# EAGLE design circuit (EAGLE 6.5.0)
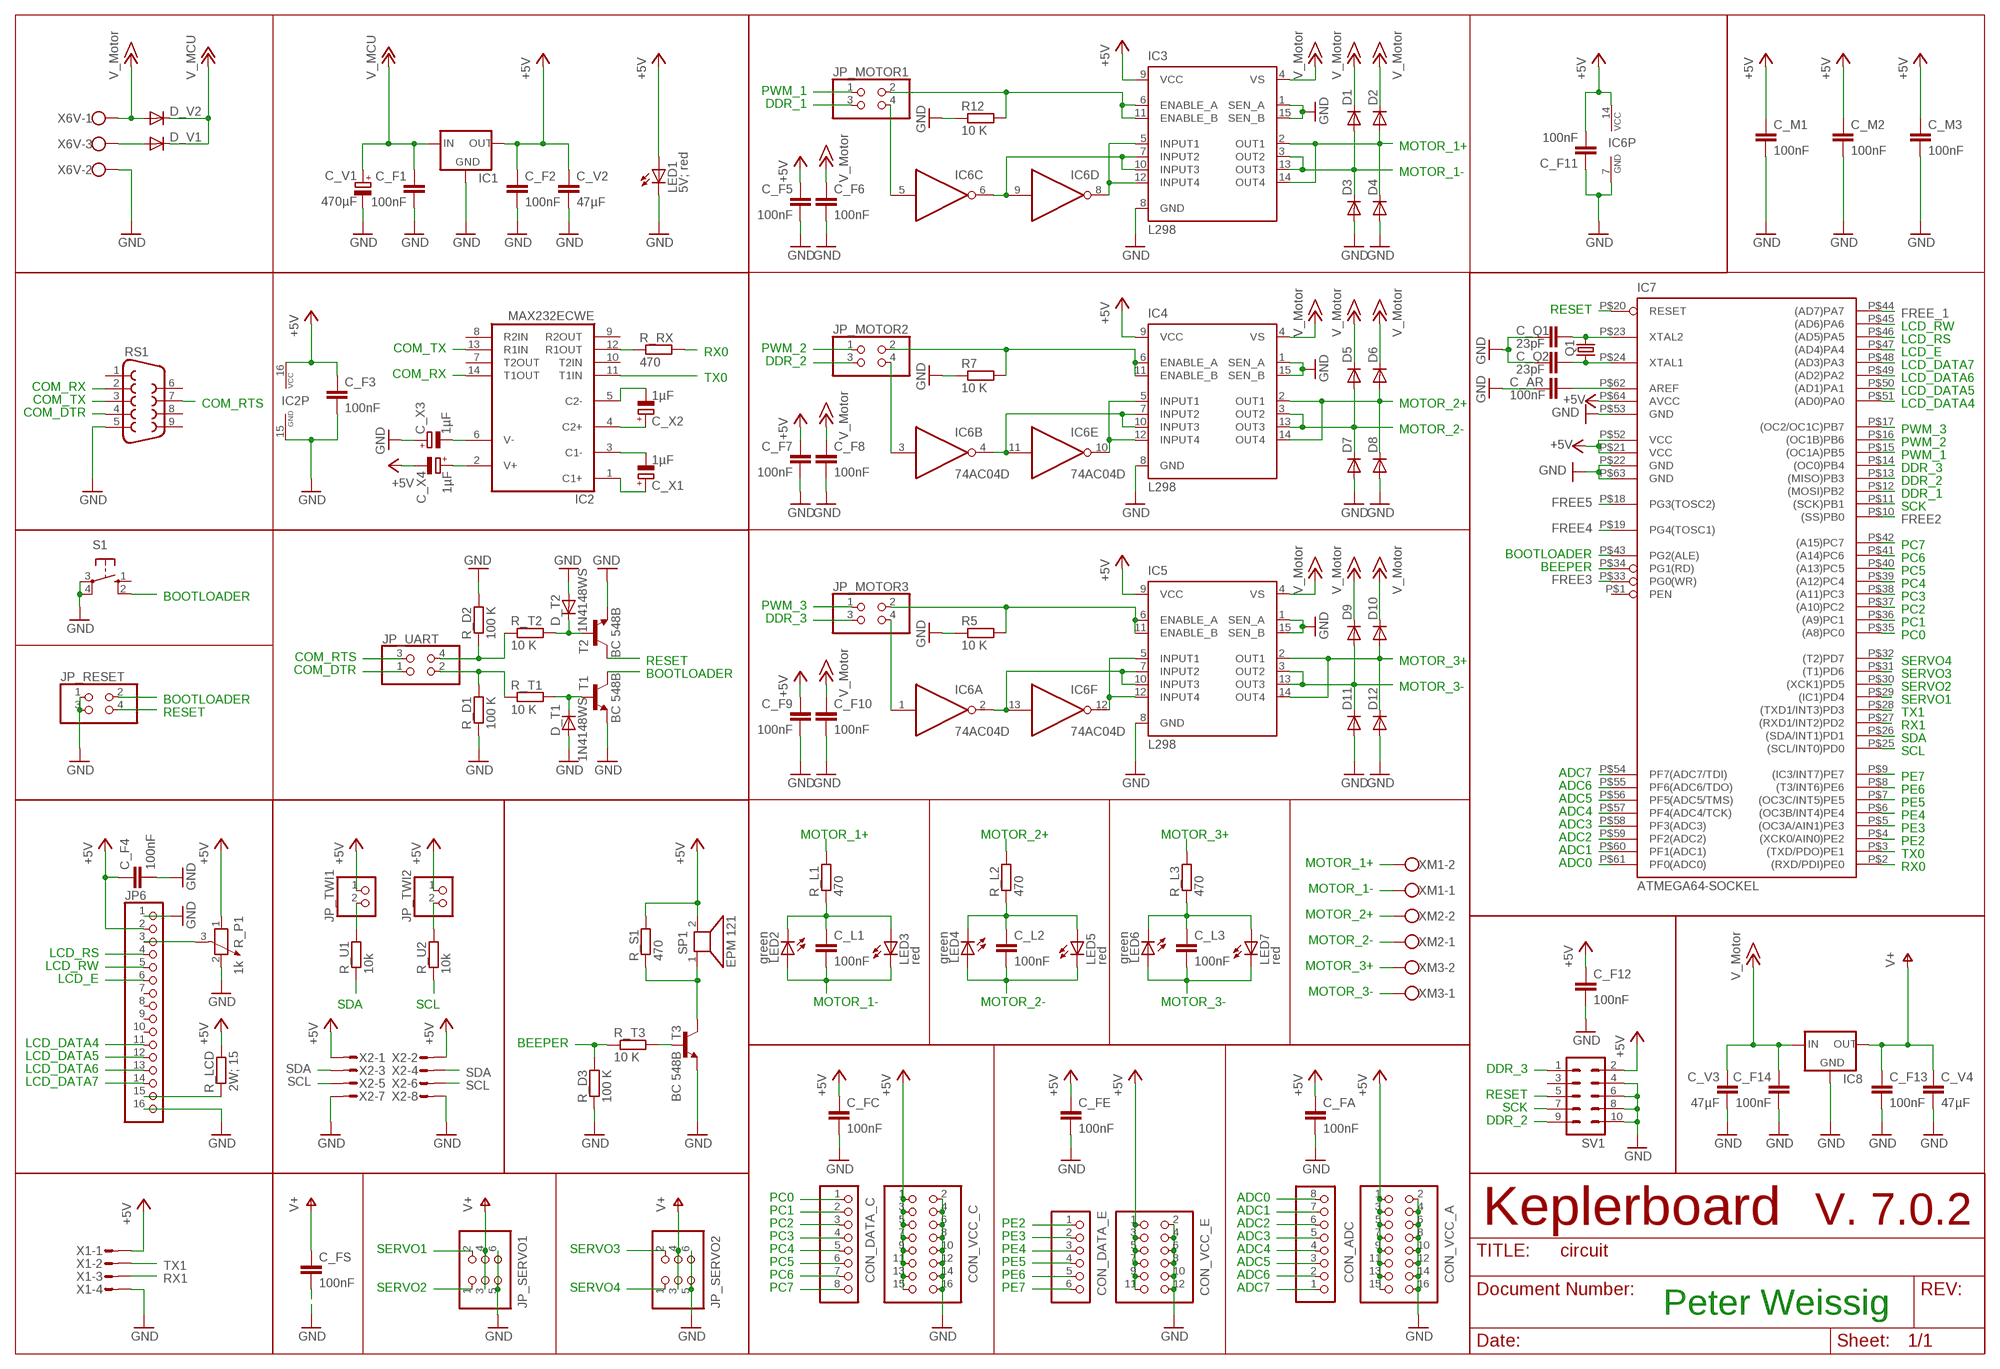
[diagram p0: schematic, sheet 1]

## Parts
C_AR  100nF  C-EU025-025X050  [C025-025X050]
C_F1  100nF  C-EUC1206K  [C1206K]
C_F2  100nF  C-EUC1206K  [C1206K]
C_F3  100nF  C-EUC1206K  [C1206K]
C_F4  100nF  C-EU025-025X050  [C025-025X050]
C_F5  100nF  C-EUC1206K  [C1206K]
C_F6  100nF  C-EUC1206K  [C1206K]
C_F7  100nF  C-EUC1206K  [C1206K]
C_F8  100nF  C-EUC1206K  [C1206K]
C_F9  100nF  C-EUC1206K  [C1206K]
C_F10  100nF  C-EUC1206K  [C1206K]
C_F11  100nF  C-EUC1206K  [C1206K]
C_F12  100nF  C-EUC1206K  [C1206K]
C_F13  100nF  C-EUC1206K  [C1206K]
C_F14  100nF  C-EUC1206K  [C1206K]
C_FA  100nF  C-EU025-025X050  [C025-025X050]
C_FC  100nF  C-EU025-025X050  [C025-025X050]
C_FE  100nF  C-EU025-025X050  [C025-025X050]
C_FS  100nF  C-EUC1206K  [C1206K]
C_L1  100nF  C-EUC1206K  [C1206K]
C_L2  100nF  C-EUC1206K  [C1206K]
C_L3  100nF  C-EUC1206K  [C1206K]
C_M1  100nF  C-EU025-025X050  [C025-025X050]
C_M2  100nF  C-EU025-025X050  [C025-025X050]
C_M3  100nF  C-EU025-025X050  [C025-025X050]
C_Q1  23pF  C-EUC3216  [C3216]
C_Q2  23pF  C-EUC3216  [C3216]
C_V1  470µF  CPOL-EUE5-10.5  [E5-10,5]
C_V2  47µF  C-EUC1210K  [C1210K]
C_V3  47µF  C-EUC1210K  [C1210K]
C_V4  47µF  C-EUC1210K  [C1210K]
C_X1  1µF  CPOL-EUA/3216-18W  [A/3216-18W]
C_X2  1µF  CPOL-EUA/3216-18W  [A/3216-18W]
C_X3  1µF  CPOL-EUA/3216-18W  [A/3216-18W]
C_X4  1µF  CPOL-EUA/3216-18W  [A/3216-18W]
CON_ADC  PINHD-1X8  [1X08]
CON_DATA_C  PINHD-1X8  [1X08]
CON_DATA_E  PINHD-1X6  [1X06]
CON_VCC_A  PINHD-2X8  [2X08]
CON_VCC_C  PINHD-2X8  [2X08]
CON_VCC_E  PINHD-2X6  [2X06]
D1  DIODE-SMC  [SMC]
D2  DIODE-SMC  [SMC]
D3  DIODE-SMC  [SMC]
D4  DIODE-SMC  [SMC]
D5  DIODE-SMC  [SMC]
D6  DIODE-SMC  [SMC]
D7  DIODE-SMC  [SMC]
D8  DIODE-SMC  [SMC]
D9  DIODE-SMC  [SMC]
D10  DIODE-SMC  [SMC]
D11  DIODE-SMC  [SMC]
D12  DIODE-SMC  [SMC]
D_T1  1N4148WS  DIODE-SOD323-W  [SOD323-W]
D_T2  1N4148WS  DIODE-SOD323-W  [SOD323-W]
D_V1  DIODE-SMC  [SMC]
D_V2  DIODE-SMC  [SMC]
IC1  78XXS  [78XXS]
IC2  MAX232ECWE  [SO16L]
IC3  L298  [MULTIWATT-15]
IC4  L298  [MULTIWATT-15]
IC5  L298  [MULTIWATT-15]
IC6  74AC04D  [SO14]
IC7  ATMEGA64-SOCKEL  [SOCKEL_TQFP64]
IC8  78XXS  [78XXS]
JP6  PINHD-1X16  [1X16]
JP_MOTOR1  PINHD-2X2  [2X02]
JP_MOTOR2  PINHD-2X2  [2X02]
JP_MOTOR3  PINHD-2X2  [2X02]
JP_RESET  PINHD-2X2  [2X02]
JP_SERVO1  PINHD-2X3  [2X03]
JP_SERVO2  PINHD-2X3  [2X03]
JP_TWI1  PINHD-1X2  [1X02]
JP_TWI2  PINHD-1X2  [1X02]
JP_UART  PINHD-2X2  [2X02]
LED1  5V; red  LED3MM  [LED3MM]
LED2  green  LEDCHIPLED_1206  [CHIPLED_1206]
LED3  red  LEDCHIPLED_1206  [CHIPLED_1206]
LED4  green  LEDCHIPLED_1206  [CHIPLED_1206]
LED5  red  LEDCHIPLED_1206  [CHIPLED_1206]
LED6  green  LEDCHIPLED_1206  [CHIPLED_1206]
LED7  red  LEDCHIPLED_1206  [CHIPLED_1206]
Q1  CRYSTALHC49UP  [HC49UP]
R5  10 K  R-EU_R1206  [R1206]
R7  10 K  R-EU_R1206  [R1206]
R12  10 K  R-EU_R1206  [R1206]
R_D1  100 K  R-EU_R1206  [R1206]
R_D2  100 K  R-EU_R1206  [R1206]
R_D3  100 K  R-EU_R1206  [R1206]
R_L1  470  R-EU_R1206  [R1206]
R_L2  470  R-EU_R1206  [R1206]
R_L3  470  R-EU_R1206  [R1206]
R_LCD  2W; 15  R-EU_0414/15  [0414/15]
R_P1  1k  POTENTIOMETER_PT-10  [PT-10]
R_RX  470  R-EU_R1206  [R1206]
R_S1  470  R-EU_R1206  [R1206]
R_T1  10 K  R-EU_R1206  [R1206]
R_T2  10 K  R-EU_R1206  [R1206]
R_T3  10 K  R-EU_R1206  [R1206]
R_U1  10k  R-EU_R1206  [R1206]
R_U2  10k  R-EU_R1206  [R1206]
RS1  F09H  [F09H]
S1  TASTER  [TASTER_SMD]
SP1  EPM 121  AL60P  [AL60P]
SV1  ML10  [ML10]
T1  BC 548B  2N3565  [TO92]
T2  BC 548B  2N3565  [TO92]
T3  BC 548B  2N3565  [TO92]
X1  MICROMATCH-4  [MICROMATCH-4]
X2  MICROMATCH-8  [MICROMATCH-8]
X6V  W237-103  [W237-103]
XM1  W237-102  [W237-102]
XM2  W237-102  [W237-102]
XM3  W237-102  [W237-102]

## Nets
+5V: C_F2.1 C_F3.1 C_F4.1 C_F5.1 C_F7.1 C_F9.1 C_F11.2 C_F12.1 C_FA.1 C_FC.1 C_FE.1 C_M1.1 C_M2.1 C_M3.1 C_V2.1 C_X4.- CON_VCC_A.1 CON_VCC_A.3 CON_VCC_A.5 CON_VCC_A.7 CON_VCC_A.9 CON_VCC_A.11 CON_VCC_A.13 CON_VCC_A.15 CON_VCC_C.1 CON_VCC_C.3 CON_VCC_C.5 CON_VCC_C.7 CON_VCC_C.9 CON_VCC_C.11 CON_VCC_C.13 CON_VCC_C.15 CON_VCC_E.1 CON_VCC_E.3 CON_VCC_E.5 CON_VCC_E.7 CON_VCC_E.9 CON_VCC_E.11 IC1.OUT IC2.16(VCC) IC3.9(VCC) IC4.9(VCC) IC5.9(VCC) IC6.14(P:VCC) IC7.P$21(VCC) IC7.P$52(VCC) IC7.P$64(AVCC) JP6.2 JP_TWI1.1 JP_TWI2.1 LED1.A R_LCD.1 R_P1.1 R_S1.2 SP1.2 SV1.2 X1.1 X2.1 X2.2
+12V: C_F1.1 C_V1.+ D_V1.C D_V2.C IC1.IN ; supply symbol labelled V_MCU
+15V: C_F6.1 C_F8.1 C_F10.1 C_F14.1 C_V3.1 D1.C D2.C D5.C D6.C D9.C D10.C D_V2.A IC3.4(VS) IC4.4(VS) IC5.4(VS) IC8.IN X6V.1 ; supply symbol labelled V_Motor
ADC0: CON_ADC.8 IC7.P$61(PF0(ADC0))
ADC1: CON_ADC.7 IC7.P$60(PF1(ADC1))
ADC2: CON_ADC.6 IC7.P$59(PF2(ADC2))
ADC3: CON_ADC.5 IC7.P$58(PF3(ADC3))
ADC4: CON_ADC.4 IC7.P$57(PF4(ADC4/TCK))
ADC5: CON_ADC.3 IC7.P$56(PF5(ADC5/TMS))
ADC6: CON_ADC.2 IC7.P$55(PF6(ADC6/TDO))
ADC7: CON_ADC.1 IC7.P$54(PF7(ADC7/TDI))
BEEPER: IC7.P$34(PG1(RD)) R_D3.2 R_T3.1
BOOTLOADER: IC7.P$43(PG2(ALE)) JP_RESET.2 S1.2(S1) T1.1(C)
COM_DTR: JP_UART.1 RS1.4
COM_RTS: JP_UART.3 RS1.7
COM_RX: IC2.14(T1OUT) RS1.2
COM_TX: IC2.13(R1IN) RS1.3
DDR_1: IC7.P$12((MOSI)PB2) JP_MOTOR1.3
DDR_2: IC7.P$13((MISO)PB3) JP_MOTOR2.3 SV1.9
DDR_3: IC7.P$14((OC0)PB4) JP_MOTOR3.3 SV1.1
FREE2: IC7.P$10((SS)PB0)
FREE3: IC7.P$33(PG0(WR))
FREE4: IC7.P$19(PG4(TOSC1))
FREE5: IC7.P$18(PG3(TOSC2))
FREE_1: IC7.P$44((AD7)PA7)
GND: C_AR.1 C_F1.2 C_F2.2 C_F3.2 C_F4.2 C_F5.2 C_F6.2 C_F7.2 C_F8.2 C_F9.2 C_F10.2 C_F11.1 C_F12.2 C_F13.2 C_F14.2 C_FA.2 C_FC.2 C_FE.2 C_FS.2 C_M1.2 C_M2.2 C_M3.2 C_Q1.1 C_Q2.1 C_V1.- C_V2.2 C_V3.2 C_V4.2 C_X3.+ CON_VCC_A.2 CON_VCC_A.4 CON_VCC_A.6 CON_VCC_A.8 CON_VCC_A.10 CON_VCC_A.12 CON_VCC_A.14 CON_VCC_A.16 CON_VCC_C.2 CON_VCC_C.4 CON_VCC_C.6 CON_VCC_C.8 CON_VCC_C.10 CON_VCC_C.12 CON_VCC_C.14 CON_VCC_C.16 CON_VCC_E.2 CON_VCC_E.4 CON_VCC_E.6 CON_VCC_E.8 CON_VCC_E.10 CON_VCC_E.12 D3.A D4.A D7.A D8.A D11.A D12.A D_T1.A D_T2.A IC1.GND IC2.15(GND) IC3.1(SEN_A) IC3.8(GND) IC3.15(SEN_B) IC4.1(SEN_A) IC4.8(GND) IC4.15(SEN_B) IC5.1(SEN_A) IC5.8(GND) IC5.15(SEN_B) IC6.7(P:GND) IC7.P$22(GND) IC7.P$53(GND) IC7.P$63(GND) IC8.GND JP6.1 JP6.16 JP_RESET.1 JP_RESET.3 JP_SERVO1.5 JP_SERVO1.6 JP_SERVO2.5 JP_SERVO2.6 LED1.K(C) R5.1 R7.1 R12.1 R_D1.1 R_D2.2 R_D3.1 R_P1.2 RS1.5 S1.3(P) S1.4(P1) SV1.4 SV1.6 SV1.8 SV1.10 T1.3(E) T2.3(E) T3.3(E) X1.4 X2.7 X2.8 X6V.2
LCD_DATA4: IC7.P$51((AD0)PA0) JP6.11
LCD_DATA5: IC7.P$50((AD1)PA1) JP6.12
LCD_DATA6: IC7.P$49((AD2)PA2) JP6.13
LCD_DATA7: IC7.P$48((AD3)PA3) JP6.14
LCD_E: IC7.P$47((AD4)PA4) JP6.6
LCD_RS: IC7.P$46((AD5)PA5) JP6.4
LCD_RW: IC7.P$45((AD6)PA6) JP6.5
MOTOR_1+: D2.A D4.C IC3.2(OUT1) IC3.14(OUT4) R_L1.2 XM1.2
MOTOR_1-: C_L1.2 D1.A D3.C IC3.3(OUT2) IC3.13(OUT3) LED2.A LED3.C XM1.1
MOTOR_2+: D6.A D8.C IC4.2(OUT1) IC4.14(OUT4) R_L2.2 XM2.2
MOTOR_2-: C_L2.2 D5.A D7.C IC4.3(OUT2) IC4.13(OUT3) LED4.A LED5.C XM2.1
MOTOR_3+: D10.A D12.C IC5.2(OUT1) IC5.14(OUT4) R_L3.2 XM3.2
MOTOR_3-: C_L3.2 D9.A D11.C IC5.3(OUT2) IC5.13(OUT3) LED6.A LED7.C XM3.1
N$2: IC6.3(B:I) JP_MOTOR2.4
N$3: IC4.7(INPUT2) IC4.10(INPUT3) IC6.4(B:O) IC6.11(E:I)
N$4: JP_TWI1.2 R_U1.2
N$5: R_S1.1 SP1.1 T3.1(C)
N$6: R_T3.2 T3.2(B)
N$16: JP6.3 R_P1.3
N$17: C_AR.2 IC7.P$62(AREF)
N$18: IC4.6(ENABLE_A) IC4.11(ENABLE_B) JP_MOTOR2.2 R7.2
N$19: JP_TWI2.2 R_U2.2
N$20: D_V1.A X6V.3
N$21: IC4.5(INPUT1) IC4.12(INPUT4) IC6.10(E:O)
N$37: C_Q1.2 IC7.P$23(XTAL2) Q1.2
N$38: C_L1.1 LED2.C LED3.A R_L1.1
N$40: C_Q2.2 IC7.P$24(XTAL1) Q1.1
N$78: IC5.5(INPUT1) IC5.12(INPUT4) IC6.12(F:O)
N$82: IC6.5(C:I) JP_MOTOR1.4
N$83: IC3.5(INPUT1) IC3.12(INPUT4) IC6.8(D:O)
N$84: IC3.7(INPUT2) IC3.10(INPUT3) IC6.6(C:O) IC6.9(D:I)
N$90: IC6.1(A:I) JP_MOTOR3.4
N$92: JP6.15 R_LCD.2
N$95: D_T2.C R_T2.2 T2.2(B)
N$99: IC5.7(INPUT2) IC5.10(INPUT3) IC6.2(A:O) IC6.13(F:I)
N$101: C_L3.1 LED6.C LED7.A R_L3.1
N$106: C_L2.1 LED4.C LED5.A R_L2.1
N$122: D_T1.C R_T1.2 T1.2(B)
N$123: C_X4.+ IC2.2(V+)
N$124: C_X3.- IC2.6(V-)
N$125: C_X2.+ IC2.4(C2+)
N$126: C_X1.+ IC2.1(C1+)
N$127: C_X1.- IC2.3(C1-)
N$128: C_X2.- IC2.5(C2-)
N$129: JP_UART.2 R_D1.2 R_T1.1
N$130: JP_UART.4 R_D2.1 R_T2.1
N$134: IC2.12(R1OUT) R_RX.1
PC0: CON_DATA_C.1 IC7.P$35((A8)PC0)
PC1: CON_DATA_C.2 IC7.P$36((A9)PC1)
PC2: CON_DATA_C.3 IC7.P$37((A10)PC2)
PC3: CON_DATA_C.4 IC7.P$38((A11)PC3)
PC4: CON_DATA_C.5 IC7.P$39((A12)PC4)
PC5: CON_DATA_C.6 IC7.P$40((A13)PC5)
PC6: CON_DATA_C.7 IC7.P$41((A14)PC6)
PC7: CON_DATA_C.8 IC7.P$42((A15)PC7)
PE2: CON_DATA_E.1 IC7.P$4((XCK0/AIN0)PE2)
PE3: CON_DATA_E.2 IC7.P$5((OC3A/AIN1)PE3)
PE4: CON_DATA_E.3 IC7.P$6((OC3B/INT4)PE4)
PE5: CON_DATA_E.4 IC7.P$7((OC3C/INT5)PE5)
PE6: CON_DATA_E.5 IC7.P$8((T3/INT6)PE6)
PE7: CON_DATA_E.6 IC7.P$9((IC3/INT7)PE7)
PWM_1: IC7.P$15((OC1A)PB5) JP_MOTOR1.1
PWM_2: IC7.P$16((OC1B)PB6) JP_MOTOR2.1
PWM_3: IC7.P$17((OC2/OC1C)PB7) JP_MOTOR3.1
PWMM1: IC3.6(ENABLE_A) IC3.11(ENABLE_B) JP_MOTOR1.2 R12.2
PWMM3: IC5.6(ENABLE_A) IC5.11(ENABLE_B) JP_MOTOR3.2 R5.2
RESET: IC7.P$20(RESET) JP_RESET.4 SV1.5 T2.1(C)
RX0: IC7.P$2((RXD/PDI)PE0) R_RX.2
RX1: IC7.P$27((RXD1/INT2)PD2) X1.3
SCK: IC7.P$11((SCK)PB1) SV1.7
SCL: IC7.P$25((SCL/INT0)PD0) R_U2.1 X2.5 X2.6
SDA: IC7.P$26((SDA/INT1)PD1) R_U1.1 X2.3 X2.4
SERVO1: IC7.P$29((IC1)PD4) JP_SERVO1.2
SERVO2: IC7.P$30((XCK1)PD5) JP_SERVO1.1
SERVO3: IC7.P$31((T1)PD6) JP_SERVO2.2
SERVO4: IC7.P$32((T2)PD7) JP_SERVO2.1
TX0: IC2.11(T1IN) IC7.P$3((TXD/PDO)PE1)
TX1: IC7.P$28((TXD1/INT3)PD3) X1.2
V+: C_F13.1 C_FS.1 C_V4.1 IC8.OUT JP_SERVO1.3 JP_SERVO1.4 JP_SERVO2.3 JP_SERVO2.4
Unconnected: IC2.7(T2OUT) IC2.8(R2IN) IC2.9(R2OUT) IC2.10(T2IN) IC7.P$1(PEN) JP6.7 JP6.8 JP6.9 JP6.10 RS1.1 RS1.6 RS1.8 RS1.9 S1.1(S) SV1.3

## Notes on the sheet
- Keplerboard | V. 7.0.2
- Peter Weissig

## Library data of the parts
C_AR C_F1-C_F14 C_FA C_FC C_FE C_FS C_L1-C_L3 C_M1-C_M3 C_Q1 C_Q2 C_V2-C_V4 = rcl:C-EU: CAPACITOR, European symbol
C_V1 C_X1-C_X4 = rcl:CPOL-EU: POLARIZED CAPACITOR, European symbol
CON_ADC CON_DATA_C = pinhead:PINHD-1X8: PIN HEADER
CON_DATA_E = pinhead:PINHD-1X6: PIN HEADER
CON_VCC_A CON_VCC_C = pinhead:PINHD-2X8: PIN HEADER
CON_VCC_E = pinhead:PINHD-2X6: PIN HEADER
D1-D12 D_T1 D_T2 D_V1 D_V2 = diode:DIODE-: DIODE
IC1 IC8 = v-reg:78XXS: VOLTAGE REGULATOR
IC2 = maxim:MAX232ECWE: RS232 TRANSEIVER
IC3-IC5 = st-microelectronics:L298: DUAL FULL-BRIDGE DRIVER; MPN: L298N; OC_FARNELL: 1589425; OC_NEWARK: 32M1527
IC6 = 74xx-eu:74*04: Hex INVERTER
IC7 = robo_ag:ATMEGA64: MICROCONTROLLER 64 Kbytes FLASH 4 Kbytes SRAM 2 Kbytes EEPROM DUAL USART 8-channel 10 bit ADC Source: avr.lbr
JP6 = pinhead:PINHD-1X16: PIN HEADER
JP_MOTOR1-JP_MOTOR3 JP_RESET JP_UART = pinhead:PINHD-2X2: PIN HEADER
JP_SERVO1 JP_SERVO2 = pinhead:PINHD-2X3: PIN HEADER
JP_TWI1 JP_TWI2 = pinhead:PINHD-1X2: PIN HEADER
LED1-LED7 = led:LED: LED OSRAM: - CHIPLED LG R971, LG N971, LY N971, LG Q971, LY Q971, LO R971, LY R971 LH N974, LH R974 LS Q976, LO Q976, LY Q976 LO Q996 - Hyper CHIPLED LW Q18S LB Q993, LB Q99A, LB R99A - SideLED LS A670, LO A670, LY A670, LG A670, LP A670 LB A673, LV A673, LT A673, LW A673 LH A674 LY A675 LS A676, LA A676, LO A676, LY A676, LW A676 LS A679, LY A679, LG A679 - Hyper Micro SIDELED® LS Y876, LA Y876, LO Y876, LY Y876 LT Y87S - SmartLED LW L88C, LW L88S LB L89C, LB L89S, LG L890 LS L89K, LO L89K, LY L89K LS L896, LA L896, LO L896, LY L896 - TOPLED LS T670, LO T670, LY T670, LG T670, LP T670 LSG T670, LSP T670, LSY T670, LOP T670, LYG T670 LG T671, LOG T671, LSG T671 LB T673, LV T673, LT T673, LW T673 LH T674 LS T676, LA T676, LO T676, LY T676, LB T676, LH T676, LSB T676, LW T676 LB T67C, LV T67C, LT T67C, LS T67K, LO T67K, LY T67K, LW E67C LS E67B, LA E67B, LO E67B, LY E67B, LB E67C, LV E67C, LT E67C LW T67C LS T679, LY T679, LG T679 LS T770, LO T770, LY T770, LG T770, LP T770 LB T773, LV T773, LT T773, LW T773 LH T774 LS E675, LA E675, LY E675, LS T675 LS T776, LA T776, LO T776, LY T776, LB T776 LHGB T686 LT T68C, LB T68C - Hyper Mini TOPLED® LB M676 - Mini TOPLED Santana® LG M470 LS M47K, LO M47K, LY M47K Source: http://www.osram.convergy.de LUXEON: - LUMILED® LXK2-PW12-R00, LXK2-PW12-S00, LXK2-PW14-U00, LXK2-PW14-V00 LXK2-PM12-R00, LXK2-PM12-S00, LXK2-PM14-U00 LXK2-PE12-Q00, LXK2-PE12-R00, LXK2-PE12-S00, LXK2-PE14-T00, LXK2-PE14-U00 LXK2-PB12-K00, LXK2-PB12-L00, LXK2-PB12-M00, LXK2-PB14-N00, LXK2-PB14-P00, LXK2-PB14-Q00 LXK2-PR12-L00, LXK2-PR12-M00, LXK2-PR14-Q00, LXK2-PR14-R00 LXK2-PD12-Q00, LXK2-PD12-R00, LXK2-PD12-S00 LXK2-PH12-R00, LXK2-PH12-S00 LXK2-PL12-P00, LXK2-PL12-Q00, LXK2-PL12-R00 Source: www.luxeon.com KINGBRIGHT: KA-3528ASYC Source: www.kingbright.com
Q1 = crystal:CRYSTAL: CRYSTAL
R5 R7 R12 R_D1-R_D3 R_L1-R_L3 R_LCD R_RX R_S1 R_T1-R_T3 R_U1 R_U2 = rcl:R-EU_: RESISTOR, European symbol
R_P1 = rcl:POTENTIOMETER_: Potentiometer
RS1 = con-subd:F09: SUB-D
S1 = robo_ag:TASTER: Kurzhubtaster
SP1 = buzzer:AL60P: SPEAKER Source: Buerklin
SV1 = con-harting-ml:ML10: HARTING; OC_FARNELL: unknown; OC_NEWARK: unknown
T1-T3 = transistor-npn:2N3565: NPN Transistor
X1 = con-amp-micromatch:MICROMATCH-4: MicroMaTch 4 7-215464-4 / 0-215464-4 Drawing Number C-215464 DDEController.pdf; MPN: 7-215464-4; OC_FARNELL: 3784629; OC_NEWARK: 19R8124
X2 = con-amp-micromatch:MICROMATCH-8: MicroMaTch 8 7-215464-8 / 0-215464-8 Drawing Number C-215464 DDEController.pdf; MF: FARNELL; MPN: 7-215464-8; OC_FARNELL: 3784642; OC_NEWARK: 26H0301
X6V = con-wago-500:W237-103: WAGO SCREW CLAMP
XM1-XM3 = con-wago-500:W237-102: WAGO SCREW CLAMP

## Board
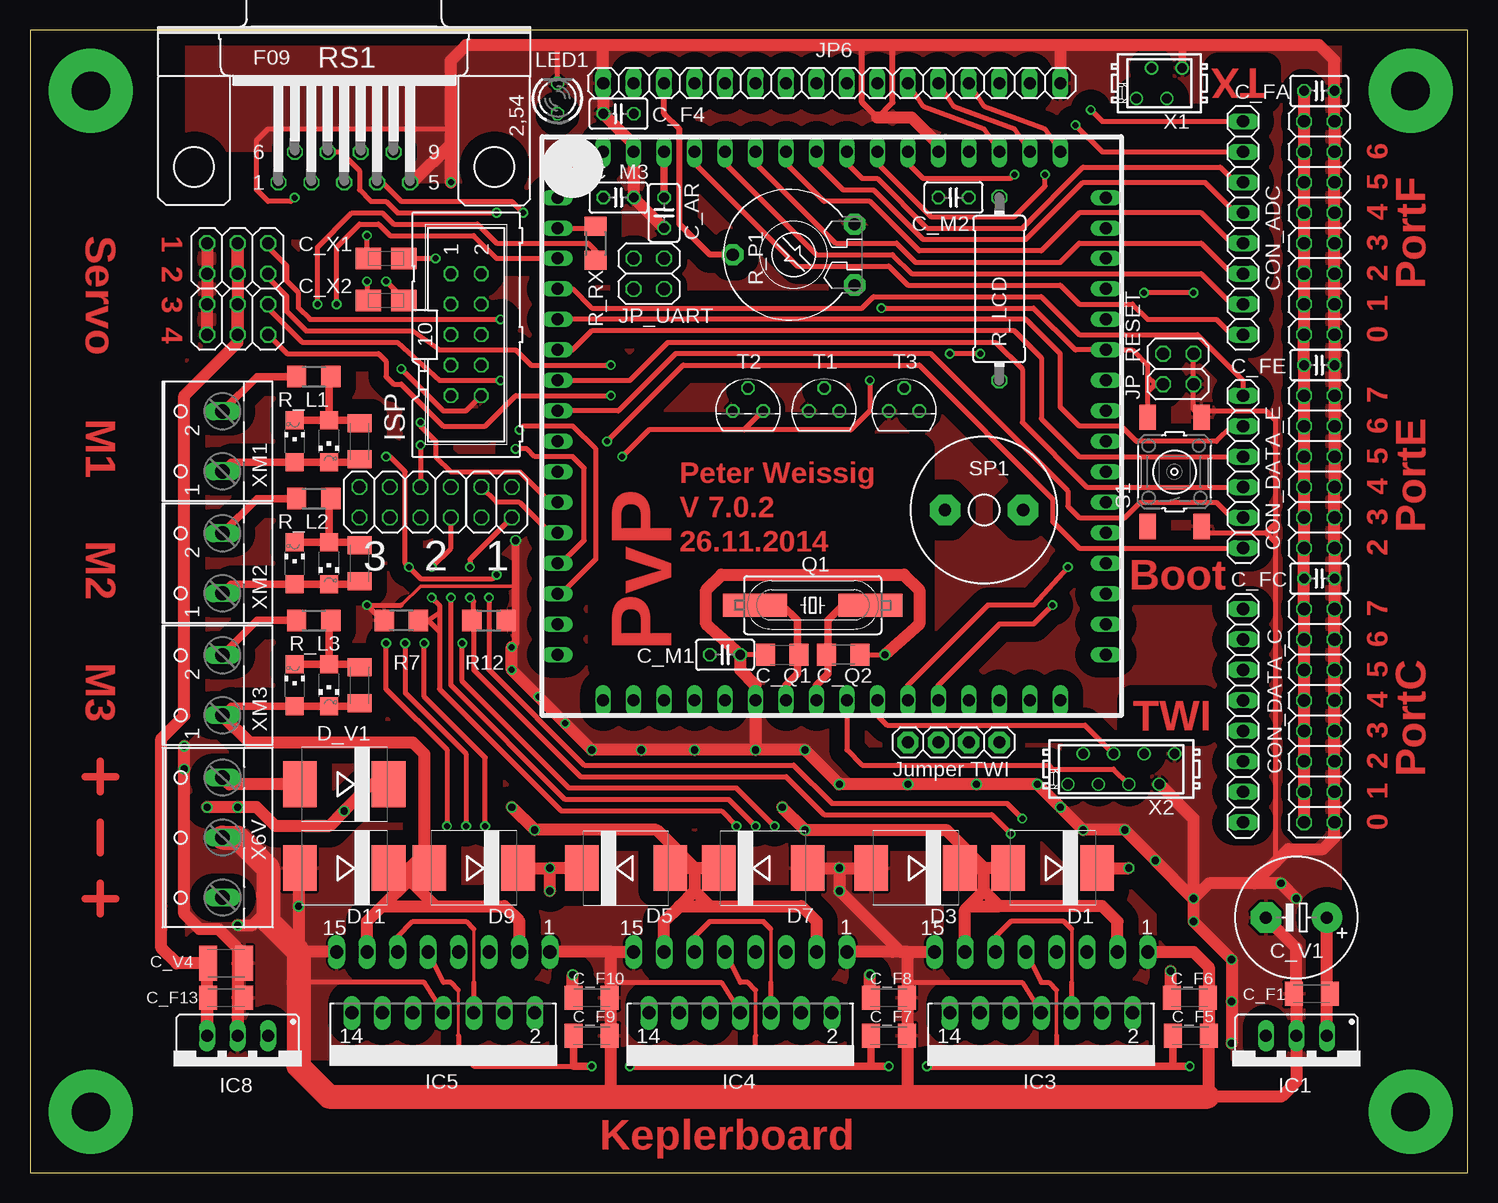
[diagram p1: board, top side]
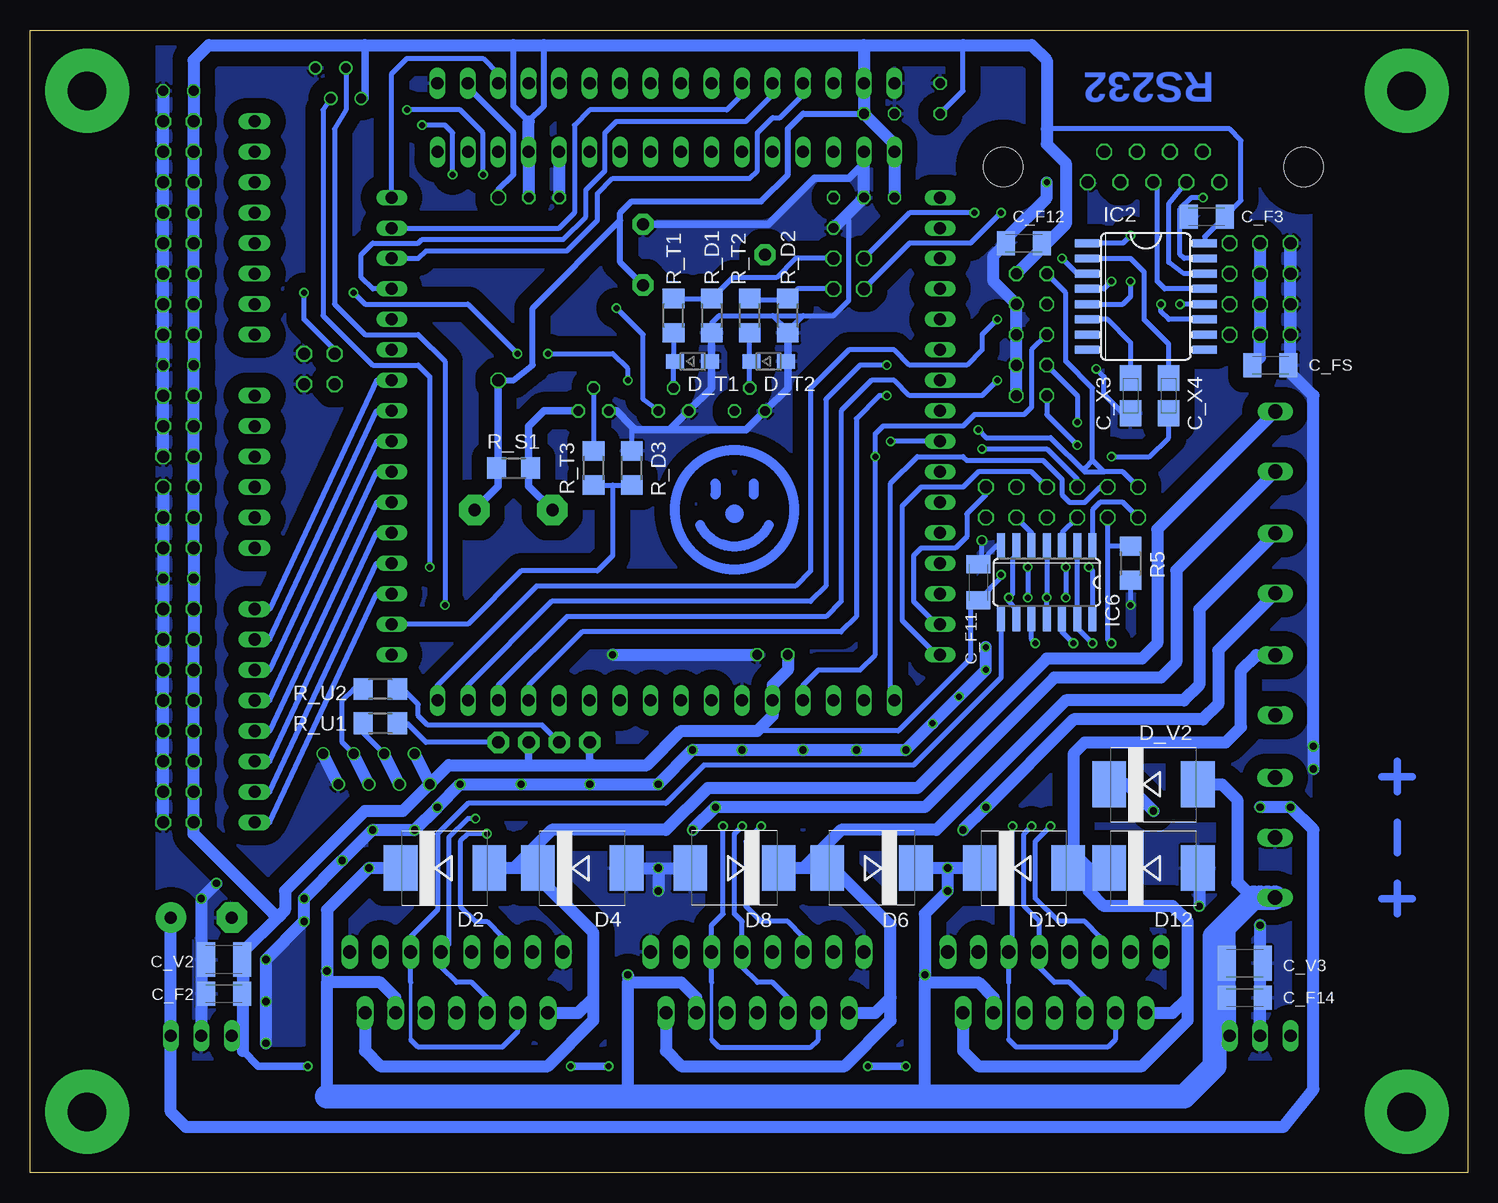
[diagram p2: board, bottom side, seen from below]

Size 119.84 x 95.24 mm. Coordinates in mm from the lower left corner, seen from the top.
Outline: 0,0 119.84,0 119.84,95.24 0,95.24 0,0
Copper layers (1*16): Top 0.07mm / dielectric 1.5mm / Bottom 0.07mm
Design rules "LeitOn - Standard-Eagle-DRU - 1- und  2-Lagen DK - deutsch - Rev 2.0 *": minimum track width 0.15mm, minimum drill 0.3mm, track to track 0.15mm, track to pad 0.15mm, pad to pad 0.15mm, via to via 0.15mm, smd to smd 0.15mm, copper to edge 0.3mm, drill to drill 0.3mm, minimum pad ring 0.15mm, minimum via ring 0.15mm, stop-mask expansion 0.075mm, vias tented up to drill 0mil, thermal gap 0.2mm
tRestrict: area 11.9,79.1 to 24.9,83.8; area 47.8,42.2 to 74.1,60.3; 11 lines
bRestrict: area 12.9,83.8 to 35.1,94.3

### Footprints (pad centres in the part's own frame; a part is rotated, then mirrored left to right if it is on the bottom)
C025-025X050 = drill 0.813 octagon: 1 -1.27,0; 2 1.27,0
C1206K = smd 1.5 x 2: 1 -1.5,0; 2 1.5,0
C3216 = smd 1.6 x 1.8: 1 -1.4,0; 2 1.4,0
E5-10,5 = drill 1.016 pad 2.54: + -2.54,0 | drill 1.016 pad 2.54 octagon: - 2.54,0
C1210K = smd 1.5 x 2.9: 1 -1.5,0; 2 1.5,0
A/3216-18W = smd 2.15 x 1.8: + 1.475,0; - -1.475,0
1X08 = drill 1.016 long: 1 -8.89,0; 2 -6.35,0; 3 -3.81,0; 4 -1.27,0; 5 1.27,0; 6 3.81,0; 7 6.35,0; 8 8.89,0
1X06 = drill 1.016 long: 1 -6.35,0; 2 -3.81,0; 3 -1.27,0; 4 1.27,0; 5 3.81,0; 6 6.35,0
2X08 = drill 1.016 octagon: 1 -8.89,-1.27; 2 -8.89,1.27; 3 -6.35,-1.27; 4 -6.35,1.27; 5 -3.81,-1.27; 6 -3.81,1.27; 7 -1.27,-1.27; 8 -1.27,1.27; 9 1.27,-1.27; 10 1.27,1.27; 11 3.81,-1.27; 12 3.81,1.27; 13 6.35,-1.27; 14 6.35,1.27; 15 8.89,-1.27; 16 8.89,1.27
2X06 = drill 1.016 octagon: 1 -6.35,-1.27; 2 -6.35,1.27; 3 -3.81,-1.27; 4 -3.81,1.27; 5 -1.27,-1.27; 6 -1.27,1.27; 7 1.27,-1.27; 8 1.27,1.27; 9 3.81,-1.27; 10 3.81,1.27; 11 6.35,-1.27; 12 6.35,1.27
SMC = smd 2.8 x 3.8: A 3.7,0; C -3.7,0
SOD323-W = smd 1.5 x 1.2: A 1.45,0; C -1.45,0
78XXS = drill 1.016 long: GND 0,-2.54; IN -2.54,-2.54; OUT 2.54,-2.54
SO16L = smd 0.66 x 2.032: 1 -4.445,-4.902; 2 -3.175,-4.902; 3 -1.905,-4.902; 4 -0.635,-4.902; 5 0.635,-4.902; 6 1.905,-4.902; 7 3.175,-4.902; 8 4.445,-4.902; 9 4.445,4.902; 10 3.175,4.902; 11 1.905,4.902; 12 0.635,4.902; 13 -0.635,4.902; 14 -1.905,4.902; 15 -3.175,4.902; 16 -4.445,4.902
MULTIWATT-15 = drill 1.1 long: 1 -8.89,-7.62; 2 -7.62,-2.54; 3 -6.35,-7.62; 4 -5.08,-2.54; 5 -3.81,-7.62; 6 -2.54,-2.54; 7 -1.27,-7.62; 8 0,-2.54; 9 1.27,-7.62; 10 2.54,-2.54; 11 3.81,-7.62; 12 5.08,-2.54; 13 6.35,-7.62; 14 7.62,-2.54; 15 8.89,-7.62
SO14 = smd 0.66 x 2.032: 1 -3.81,-3.073; 2 -2.54,-3.073; 3 -1.27,-3.073; 4 0,-3.073; 5 1.27,-3.073; 6 2.54,-3.073; 7 3.81,-3.073; 8 3.81,3.073; 9 2.54,3.073; 10 1.27,3.073; 11 0,3.073; 12 -1.27,3.073; 13 -2.54,3.073; 14 -3.81,3.073
SOCKEL_TQFP64 = drill 1 long: P$1 -22.86,19.05; P$2 -22.86,16.51; P$3 -22.86,13.97; P$4 -22.86,11.43; P$5 -22.86,8.89; P$6 -22.86,6.35; P$7 -22.86,3.81; P$8 -22.86,1.27; P$9 -22.86,-1.27; P$10 -22.86,-3.81; P$11 -22.86,-6.35; P$12 -22.86,-8.89; P$13 -22.86,-11.43; P$14 -22.86,-13.97; P$15 -22.86,-16.51; P$16 -22.86,-19.05; P$17 -19.05,-22.86; P$18 -16.51,-22.86; P$19 -13.97,-22.86; P$20 -11.43,-22.86; P$21 -8.89,-22.86; P$22 -6.35,-22.86; P$23 -3.81,-22.86; P$24 -1.27,-22.86; P$25 1.27,-22.86; P$26 3.81,-22.86; P$27 6.35,-22.86; P$28 8.89,-22.86; P$29 11.43,-22.86; P$30 13.97,-22.86; P$31 16.51,-22.86; P$32 19.05,-22.86; P$33 22.86,-19.05; P$34 22.86,-16.51; P$35 22.86,-13.97; P$36 22.86,-11.43; P$37 22.86,-8.89; P$38 22.86,-6.35; P$39 22.86,-3.81; P$40 22.86,-1.27; P$41 22.86,1.27; P$42 22.86,3.81; P$43 22.86,6.35; P$44 22.86,8.89; P$45 22.86,11.43; P$46 22.86,13.97; P$47 22.86,16.51; P$48 22.86,19.05; P$49 19.05,22.86; P$50 16.51,22.86; P$51 13.97,22.86; P$52 11.43,22.86; P$53 8.89,22.86; P$54 6.35,22.86; P$55 3.81,22.86; P$56 1.27,22.86; P$57 -1.27,22.86; P$58 -3.81,22.86; P$59 -6.35,22.86; P$60 -8.89,22.86; P$61 -11.43,22.86; P$62 -13.97,22.86; P$63 -16.51,22.86; P$64 -19.05,22.86
1X16 = drill 1.016 long: 1 -19.05,0; 2 -16.51,0; 3 -13.97,0; 4 -11.43,0; 5 -8.89,0; 6 -6.35,0; 7 -3.81,0; 8 -1.27,0; 9 1.27,0; 10 3.81,0; 11 6.35,0; 12 8.89,0; 13 11.43,0; 14 13.97,0; 15 16.51,0; 16 19.05,0
2X02 = drill 1.016 octagon: 1 -1.27,-1.27; 2 -1.27,1.27; 3 1.27,-1.27; 4 1.27,1.27
2X03 = drill 1.016 octagon: 1 -2.54,-1.27; 2 -2.54,1.27; 3 0,-1.27; 4 0,1.27; 5 2.54,-1.27; 6 2.54,1.27
1X02 = drill 1.016 pad 1.778 octagon: 1 -1.27,0; 2 1.27,0
LED3MM = drill 0.813 octagon: A -1.27,0; K 1.27,0
CHIPLED_1206 = smd 1.5 x 1.5: A 0,-1.75; C 0,1.75
HC49UP = smd 5.334 x 1.93: 1 -4.826,0; 2 4.826,0
R1206 = smd 1.6 x 1.803: 1 -1.422,0; 2 1.422,0
0414/15 = drill 1.016 octagon: 1 -7.62,0; 2 7.62,0
PT-10 = drill 1.016 pad 1.778 octagon: 1 -2.54,-5.08; 2 2.54,-5.08; 3 0,5.08
F09H = drill 1.016 octagon: 1 -5.486,-1.27; 2 -2.743,-1.27; 3 0,-1.27; 4 2.743,-1.27; 5 5.486,-1.27; 6 -4.115,1.27; 7 -1.372,1.27; 8 1.372,1.27; 9 4.115,1.27 | hole 3.302: -12.522,0; 12.522,0
TASTER_SMD = smd 2.1 x 1.4: 1 -4.55,2.25; 2 4.55,2.25; 3 -4.55,-2.25; 4 4.55,-2.25
AL60P = drill 1.016 pad 2.54 octagon: 1 -3.251,0; 2 3.251,0
ML10 = drill 0.914 octagon: 1 -5.08,-1.27; 2 -5.08,1.27; 3 -2.54,-1.27; 4 -2.54,1.27; 5 0,-1.27; 6 0,1.27; 7 2.54,-1.27; 8 2.54,1.27; 9 5.08,-1.27; 10 5.08,1.27
TO92 = drill 0.813 octagon: 1 1.27,0; 2 0,1.905; 3 -1.27,0
MICROMATCH-4 = drill 0.813: 1 1.905,1.27; 2 0.635,-1.27; 3 -0.635,1.27; 4 -1.905,-1.27
MICROMATCH-8 = drill 0.813: 1 4.445,1.27; 2 3.175,-1.27; 3 1.905,1.27; 4 0.635,-1.27; 5 -0.635,1.27; 6 -1.905,-1.27; 7 -3.175,1.27; 8 -4.445,-1.27
W237-103 = drill 1.194 long: 1 -5,-1.29; 2 0,-1.29; 3 5,-1.29
W237-102 = drill 1.194 long: 1 -2.5,-1.27; 2 2.5,-1.27

### Placement (x,y rotation side)
C_AR  52.86,80.01 90 top
C_F1  106.84,14.92 180 top
C_F2  103.66,14.92 180 bottom
C_F3  21.75,79.69 180 bottom
C_F4  49.05,88.26 180 top
C_F5  96.77,11.43 0 top
C_F6  96.68,14.61 0 top
C_F7  71.6,11.43 0 top
C_F8  71.6,14.61 0 top
C_F9  46.83,11.43 0 top
C_F10  46.83,14.61 0 top
C_F11  40.8,49.21 270 bottom
C_F12  36.99,77.47 180 bottom
C_F13  16.35,14.61 0 top
C_F14  18.57,14.61 0 bottom
C_FA  107.47,90.17 0 top
C_FC  107.47,49.53 0 top
C_FE  107.47,67.31 0 top
C_FS  16.44,67.31 0 bottom
C_L1  27.46,60.96 270 top
C_L2  27.46,50.8 270 top
C_L3  27.46,40.64 270 top
C_M1  57.94,43.18 0 top
C_M2  76.99,81.28 180 top
C_M3  49.05,81.28 0 top
C_Q1  62.71,43.18 0 top
C_Q2  67.79,43.18 180 top
C_V1  105.57,21.27 180 top
C_V2  103.66,17.78 180 bottom
C_V3  18.57,17.46 0 bottom
C_V4  16.35,17.46 0 top
C_X1  29.69,76.2 180 top
C_X2  29.69,72.71 0 top
C_X3  28.1,64.77 270 bottom
C_X4  24.92,64.77 90 bottom
CON_ADC  101.12,78.74 270 top
CON_DATA_C  101.12,38.1 90 top
CON_DATA_E  101.12,58.42 270 top
CON_VCC_A  107.47,78.74 270 top
CON_VCC_C  107.47,38.1 270 top
CON_VCC_E  107.47,58.42 270 top
D1  85.25,25.4 180 top
D2  85.25,25.4 0 bottom
D3  73.82,25.4 180 top
D4  73.82,25.4 0 bottom
D5  49.69,25.4 0 top
D6  49.69,25.4 180 bottom
D7  61.12,25.4 0 top
D8  61.12,25.4 180 bottom
D9  36.99,25.4 180 top
D10  36.99,25.4 0 bottom
D11  26.19,25.4 180 top
D12  26.19,25.4 0 bottom
D_T1  64.61,67.63 0 bottom
D_T2  58.26,67.63 0 bottom
D_V1  26.19,32.38 180 top
D_V2  26.19,32.38 0 bottom
IC1  105.57,8.89 180 top
IC2  26.83,73.03 270 bottom
IC3  84.3,10.79 180 top
IC4  59.21,10.79 180 top
IC5  34.45,10.79 180 top
IC6  35.08,49.21 180 bottom
IC7  66.83,62.23 0 top
IC8  17.3,8.89 180 top
JP6  66.83,90.81 0 top
JP_MOTOR1  38.89,55.88 180 top
JP_MOTOR2  33.81,55.88 180 top
JP_MOTOR3  28.73,55.88 180 top
JP_RESET  95.73,66.99 90 top
JP_SERVO1  17.3,71.12 180 top
JP_SERVO2  17.3,76.2 180 top
JP_TWI1  79.53,35.88 0 top
JP_TWI2  74.45,35.88 0 top
JP_UART  51.59,74.93 270 top
LED1  43.97,89.53 90 top
LED2  22.07,60.96 0 top
LED3  24.92,60.96 180 top
LED4  22.07,50.8 0 top
LED5  24.92,50.8 180 top
LED6  22.07,40.64 0 top
LED7  24.92,40.64 180 top
Q1  65.25,47.31 180 top
R5  28.1,50.8 90 bottom
R7  30.96,46.04 0 top
R12  38.26,46.04 180 top
R_D1  63.02,71.44 90 bottom
R_D2  56.67,71.44 270 bottom
R_D3  69.69,58.74 270 bottom
R_L1  23.65,66.36 180 top
R_L2  23.65,56.2 180 top
R_L3  23.65,46.04 180 top
R_LCD  80.8,73.66 90 top
R_P1  63.66,76.52 90 top
R_RX  47.15,77.47 90 top
R_S1  79.53,58.74 180 bottom
R_T1  66.2,71.44 270 bottom
R_T2  59.85,71.44 270 bottom
R_T3  72.87,58.74 90 bottom
R_U1  90.65,37.47 0 bottom
R_U2  90.65,40.32 0 bottom
RS1  26.19,83.82 0 top
S1  95.41,58.42 90 top
SP1  79.53,55.24 0 top
SV1  36.35,69.85 270 top
T1  66.2,63.5 0 top
T2  59.85,63.5 0 top
T3  72.87,63.5 0 top
X1  94.14,90.81 180 top
X2  90.96,33.66 180 top
X6V  14.76,27.94 90 top
XM1  14.76,60.96 90 top
XM2  14.76,50.8 90 top
XM3  14.76,40.64 90 top

### Tracks (layer width: path | path; a pad name or v marks a point on that pad's centre or on a via)
+5V  (via drill 0.5)
  Top 0.254: 35.72,11.43 35.72,15.24
  Top 0.305: 60.48,11.43 60.48,15.24 | 85.57,15.24 85.57,11.43
  Top 0.406: 35.72,15.24 35.08,15.88 34.45,15.88 IC5.9 | 35.72,11.43 35.72,10.16 36.99,8.89 45.33,8.89 | 60.48,8.89 60.48,11.43 | 60.48,15.24 59.85,15.88 59.21,15.88 IC4.9 | IC3.9 84.3,15.88 84.93,15.88 85.57,15.24 | 85.57,11.43 85.57,8.89 | v38.89,49.85 38.58,49.53 32.54,49.53 v31.59,50.48 31.27,50.8 31.27,58.42 30,59.69 v29.69,59.69
  Top 0.61: v50.01,8.89 60.48,8.89 70.1,8.89 | 70.1,8.89 v71.6,8.89 | v74.77,8.89 85.57,8.89 95.27,8.89 | 95.27,8.89 v96.68,8.89 | v46.83,8.89 45.33,8.89 C_F9.1 | C_F7.1 70.1,8.89 | C_F5.1 95.27,8.89
  Top 1.016: CON_VCC_C.15 CON_VCC_C.13 CON_VCC_C.11 CON_VCC_C.9 CON_VCC_C.7 CON_VCC_C.5 CON_VCC_C.3 CON_VCC_C.1 C_FC.1 CON_VCC_E.11 CON_VCC_E.9 CON_VCC_E.7 CON_VCC_E.5 CON_VCC_E.3 CON_VCC_E.1 C_FE.1 CON_VCC_A.15 CON_VCC_A.13 CON_VCC_A.11 CON_VCC_A.9 CON_VCC_A.7 CON_VCC_A.5 CON_VCC_A.3 CON_VCC_A.1 C_FA.1
  Bottom 0.406: v31.59,50.48 31.27,50.16 IC6.14 | 99.54,21.59 99.22,21.27 | v38.89,49.85 38.89,49.62 C_F11.2 41.43,47.08 41.43,42.86 47.47,36.83 59.21,36.83 | LED1.A 42.07,90.17 42.07,93.98 | 35.08,87 19.84,87 18.89,86.04 18.89,81.05 C_F3.1 21.93,78.01 IC2.16 | v29.69,59.69 26.51,59.69 24.92,61.28 C_X4.-
  Bottom 0.508: 76.99,93.98 76.99,88.9 78.26,87.63 79.53,88.9 79.53,93.98 | R_P1.1 70.64,75.88 70.64,79.38 | 70.64,79.38 70.64,80.01 69.69,80.96 58.9,80.96 56.67,83.19 56.67,87 55.4,88.26 C_F4.1 | R_LCD.1 79.53,66.04 77.95,67.31 77.95,72.07 70.64,79.38
  Bottom 0.61: v46.83,8.89 v50.01,8.89 | v71.6,8.89 v74.77,8.89 | v96.68,8.89 100.81,8.89 102.08,10.16 | X1.1 91.92,89.53 91.92,93.98 | SP1.2 80.8,57.23 80.8,58.74 | 80.8,58.74 R_LCD.1 | R_S1.2 80.8,58.74 | JP_TWI2.1 73.18,33.97 72.87,33.97 | JP_TWI1.1 78.26,33.97
  Bottom 1.016: C_M1.1 56.67,41.91 57.94,40.64 IC7.P$21 57.94,38.1 59.21,36.83 65.56,36.83 68.42,33.97 72.87,33.97 78.26,33.97 84.93,33.97 X2.1 | 50.32,93.98 42.07,93.98 36.35,93.98 35.08,92.71 35.08,87 35.08,85.72 33.5,84.14 33.5,79.06 35.08,77.47 | 50.32,93.98 JP6.2 C_F4.1 47.78,85.72 IC7.P$64 C_M3.1 | 50.32,93.98 76.99,93.98 79.53,93.98 91.92,93.98 104.93,93.98 106.2,92.71 C_FA.1 CON_VCC_A.1 CON_VCC_A.3 CON_VCC_A.5 CON_VCC_A.7 CON_VCC_A.9 CON_VCC_A.11 CON_VCC_A.13 CON_VCC_A.15 C_FE.1 CON_VCC_E.1 CON_VCC_E.3 CON_VCC_E.5 CON_VCC_E.7 CON_VCC_E.9 CON_VCC_E.11 C_FC.1 CON_VCC_C.1 CON_VCC_C.3 CON_VCC_C.5 CON_VCC_C.7 CON_VCC_C.9 CON_VCC_C.11 CON_VCC_C.13 CON_VCC_C.15 106.2,28.26 99.54,21.59 | 102.08,10.16 102.08,11.43 | 102.08,11.43 102.08,14.92 | 102.08,14.92 102.08,17.78 C_V2.1 | X2.1 88.74,30.16 91.92,30.16 98.58,23.49 98.58,21.91 99.22,21.27 102.08,18.41 102.08,15.01 C_F2.1 102.08,14.92 | IC1.OUT 102.08,11.43 | SV1.2 35.08,77.47 | C_F12.1 35.08,77.47 | C_M2.1 IC7.P$52 78.26,87.63 | X2.2 X2.1
+12V  (via drill 0.6)
  Top 1.016: v14.76,30.48 v17.3,30.48 18.89,30.48 20.48,28.89 24.92,28.89 v26.19,30.16 28.42,32.38 D_V2.C | IC1.IN 108.11,14.92 | 108.11,14.92 C_V1.+ | C_F1.1 108.11,14.92
  Bottom 1.016: v26.19,30.16 28.42,32.38 D_V2.C | v17.3,30.48 v14.76,30.48 12.86,28.57 12.86,6.98 15.4,3.81 106.84,3.81 108.11,5.08 IC1.IN C_V1.+
+15V  (via drill 0.6)
  Top 1.016: C_F10.1 45.24,14.61 v45.24,16.51 | D6.C v43.34,25.4 | C_F8.1 70.01,14.69 v70.01,16.51 | D10.C v43.34,25.4 | C_F6.1 95.09,14.69 v95.09,16.83 | D2.C v91.6,25.4 | v43.34,23.49 v43.34,25.4
  Bottom 1.016: 45.24,6.35 45.24,15.88 | 45.24,15.88 40.8,15.88 39.53,14.61 IC5.4 | 70.01,6.35 70.01,15.88 | 70.01,15.88 65.56,15.88 64.29,14.61 IC4.4 | 95.09,6.35 95.09,15.88 | C_F14.1 19.84,14.38 IC8.IN 19.84,20.4 17.3,22.94 | 45.24,15.88 v45.24,16.51 45.24,21.59 v43.34,23.49 v43.34,25.4 | C_V3.1 21.11,17.46 | 45.24,24.66 D6.C 45.88,25.4 43.97,25.4 v43.34,25.4 | v70.01,16.51 70.01,15.88 | D_V2.A 20.48,32.38 19.21,31.11 19.21,24.21 17.94,22.94 16.67,22.94 | D10.C v43.34,25.4 | IC3.4 89.38,14.61 90.65,15.88 95.09,15.88 | 95.09,15.88 v95.09,16.83 95.09,21.91 v91.6,25.4 D2.C
  Bottom 2: 95.09,6.35 70.01,6.35 45.24,6.35 23.65,6.35 21.11,8.89 21.11,17.46 21.11,19.69 17.86,22.94 17.3,22.94 16.67,22.94 X6V.1
ADC0
  Top 0.406: IC7.P$61 55.4,84.14 63.98,75.56 71.6,75.56 73.18,73.98 85.88,73.98 87.47,72.39 91.92,72.39 93.19,71.12 98.9,71.12 100.17,69.85 CON_ADC.8
ADC1
  Top 0.406: IC7.P$60 57.94,84.14 65.56,76.52 71.91,76.52 73.5,74.93 97.63,74.93 100.17,72.39 CON_ADC.7
ADC2
  Top 0.406: IC7.P$59 60.48,84.14 67.15,77.47 72.23,77.47 73.82,75.88 85.88,75.88 87.47,77.47 97.63,77.47 100.17,74.93 CON_ADC.6
ADC3
  Top 0.406: CON_ADC.5 100.17,77.47 97.63,80.01 87.47,80.01 84.3,76.84 74.14,76.84 70.01,80.96 66.2,80.96 63.02,84.14 IC7.P$58
ADC4
  Top 0.406: IC7.P$57 65.56,84.14 67.79,81.91 70.33,81.91 74.45,77.79 83.03,77.79 87.79,82.55 97.95,82.55 100.49,80.01 CON_ADC.4
ADC5
  Top 0.406: IC7.P$56 68.1,84.14 69.37,82.87 70.64,82.87 74.77,78.74 82.71,78.74 87.79,83.82 99.22,83.82 100.49,82.55 CON_ADC.3
ADC6  (via drill 0.5)
  Top 0.406: IC7.P$55 70.64,84.14 75.09,79.69 82.07,79.69 84.61,82.23 v84.61,83.19 | v87.15,87.31 89.38,85.09 CON_ADC.2
  Bottom 0.406: v84.61,83.19 84.61,86.68 85.25,87.31 v87.15,87.31
ADC7  (via drill 0.5)
  Top 0.406: IC7.P$54 73.18,84.14 74.45,82.87 81.76,82.87 v82.07,83.19 | v88.42,88.58 89.38,87.63 CON_ADC.1
  Bottom 0.406: v82.07,83.19 82.07,86.68 83.98,88.58 v88.42,88.58
BEEPER
  Bottom 0.406: R_D3.2 R_T3.1 71.28,57.32 71.28,51.44 72.55,50.16 78.9,50.16 83.34,45.72 IC7.P$34
BOOTLOADER  (via drill 0.5)
  Top 0.406: v70.96,72.07 83.66,72.07 87.15,68.58 IC7.P$43 91.89,68.58 93.16,67.31 93.16,66.36 | 93.16,66.36 S1.2 | 93.82,65.72 93.79,65.72 93.16,66.36 | 93.82,65.72 93.19,65.09 | 93.82,65.72 JP_RESET.2
  Bottom 0.406: T1.1 68.74,64.45 68.74,69.85 v70.96,72.07
COM_DTR  (via drill 0.5)
  Top 0.406: RS1.4 29.37,82.55 30.96,80.96 40.16,80.96 v41.12,80.01
  Bottom 0.406: v41.12,80.01 46.51,80.01 JP_UART.1
COM_RTS  (via drill 0.5)
  Top 0.406: RS1.7 25.88,85.09 27.46,83.5 27.46,81.91 28.42,80.96 29.69,80.96 30.64,80.01 v38.89,80.01
  Bottom 0.406: v38.89,80.01 41.43,77.47 46.51,77.47 JP_UART.3
COM_RX
  Bottom 0.406: IC2.14 23.65,74.93 24.92,75.88 24.92,80.76 RS1.2
COM_TX
  Bottom 0.406: IC2.13 25.24,73.66 25.88,74.3 25.88,82.23 RS1.3
DDR_1
  Top 0.406: JP_MOTOR1.3 38.89,55.88 40.8,55.88 43.34,53.34 IC7.P$12
DDR_2  (via drill 0.5)
  Top 0.406: IC7.P$13 44.29,50.8 46.2,52.7 46.2,58.74 45.24,59.69 42.07,59.69 41.43,60.33 v40.48,60.33 | 32.54,57.78 JP_MOTOR2.3 v32.54,60.64
  Bottom 0.406: JP_MOTOR2.3 32.54,57.78 35.08,60.33 v40.48,60.33 | SV1.9 35.08,63.18 v32.54,60.64
DDR_3  (via drill 0.5)
  Top 0.406: IC7.P$14 44.29,48.26 47.15,51.12 47.15,60.33 45.24,62.23 41.12,62.23 v40.8,61.91
  Bottom 0.406: v40.8,61.91 40.16,61.28 34.77,61.28 31.91,58.42 30.32,58.42 | JP_MOTOR3.3 28.73,58.42 30.32,58.42 | 30.32,58.42 31.27,59.37 | 31.27,59.37 31.27,65.41 33.5,67.63 33.5,73.34 SV1.1 | 31.27,59.37 31.91,58.74
GND  (via drill 0.5, 0.6)
  Top 0.305: 30.96,47.31 32.54,48.9 40.48,48.9
  Top 0.406: IC5.8 32.86,15.88 22.38,15.88 | IC4.8 57.63,15.88 48.42,15.88 | IC3.8 82.71,15.88 73.18,15.88 | 48.42,13.65 48.1,14.29 | 71.91,18.41 71.6,18.41 | 48.1,15.79 48.42,16.51 | R7.1 29.37,46.04 v28.1,47.31 30.96,47.31 | LED1.K 43.97,93.98 | v22.07,81.28 21.75,80.96 19.84,80.96 18.89,81.91 18.89,86.04 19.84,87 35.08,87 | v30.96,66.99 34.45,63.5 36.35,63.5 SV1.10 | C_Q1.1 C_M1.2 | C_Q2.1 v71.28,43.18 | 103.82,52.55 103.82,62.71 103.03,63.5 98.19,63.5 S1.4 97,63.63 JP_RESET.1 JP_RESET.3 | 103.82,52.55 103.82,25.88 | S1.3 98.19,53.34 103.03,53.34 | 103.03,53.34 103.82,52.55 | 103.03,53.34 103.66,53.98
  Top 0.508: 69.37,93.98 69.37,89.22 70.64,87.95 71.91,89.22 71.91,93.66
  Top 0.61: 60.48,39.69 IC7.P$22 | v40.48,52.7 40.48,48.9 40.48,46.04 | R12.1 40.48,46.04 | 40.48,46.04 40.48,44.13 v40.16,43.81 | X1.4 96.04,93.98 95.73,93.98
  Top 1.016: 48.42,18.41 IC5.1 | 48.42,18.41 IC4.15 | 73.18,18.41 IC3.15 | 48.42,6.35 48.42,11.43 | 48.42,14.61 48.42,15.88 48.42,16.51 48.42,18.41 | 73.18,6.35 73.18,11.43 | 73.18,11.43 73.18,14.61 | 73.18,18.41 73.18,15.88 73.18,14.61 | 73.18,18.41 72.55,18.41 | 72.55,18.41 71.91,18.41 IC4.1 | 85.88,93.98 95.73,93.98 107.47,93.98 108.74,92.71 C_FA.2 CON_VCC_A.2 CON_VCC_A.4 CON_VCC_A.6 CON_VCC_A.8 CON_VCC_A.10 CON_VCC_A.12 CON_VCC_A.14 CON_VCC_A.16 C_FE.2 CON_VCC_E.2 CON_VCC_E.4 CON_VCC_E.6 CON_VCC_E.8 CON_VCC_E.10 CON_VCC_E.12 C_FC.2 CON_VCC_C.2 CON_VCC_C.4 CON_VCC_C.6 CON_VCC_C.8 CON_VCC_C.10 CON_VCC_C.12 CON_VCC_C.14 CON_VCC_C.16 108.74,27.94 107.79,26.99 104.93,26.99 103.82,25.88 102.08,24.13 | 85.88,93.98 69.37,93.98 47.78,93.98 | 47.78,93.98 43.97,93.98 36.35,93.98 35.08,92.71 35.08,87 35.08,85.72 | 85.88,93.98 JP6.16 | v12.86,35.56 v12.86,33.66 12.86,21.59 14.13,20.32 15.72,20.32 17.3,18.73 17.3,17.46 | JP_SERVO1.6 JP_SERVO1.5 JP_SERVO2.6 JP_SERVO2.5 | IC5.15 22.38,18.41 v22.38,22.23 22.38,25.29 D11.A | 22.38,16.69 22.38,15.88 | C_F13.2 17.3,14.61 | 17.3,14.61 IC8.GND | C_V4.2 17.3,17.46 | 17.3,17.46 17.3,14.61 | 19.53,20.64 19.84,20.95 | v17.3,20.64 18.57,20.64 19.84,21.91 19.84,23.18 | C_F9.2 48.42,11.43 | 48.42,11.43 48.42,13.65 48.42,14.61 | C_F10.2 48.42,14.61 | C_F8.2 73.18,14.61 | C_F7.2 73.18,11.43 | 64.93,25.4 D7.A v67.47,25.4 | v67.47,25.4 D3.A | IC3.1 97,18.41 98.27,17.14 98.27,14.52 | 98.27,14.52 C_F5.2 98.27,6.44 98.18,6.35 104.3,6.35 105.57,7.62 IC1.GND | C_F6.2 98.27,14.52 | IC1.GND 105.66,11.43 | C_V1.- 105.57,18.73 105.57,14.92 | 105.57,14.92 IC1.GND | C_F1.2 105.57,14.92 | v97,22.86 v93.82,26.04 v91.28,28.57 v87.79,28.57 v85.88,30.48 v83.98,32.38 v78.9,32.38 v73.18,32.38 v67.47,32.38 v64.61,35.24 v60.48,35.24
  Top 1.016: v60.48,35.24 v55.4,35.24 v50.96,35.24 v46.83,35.24 v44.61,37.47 v42.39,39.69 v40.16,41.91 v40.16,43.81 | v105.57,22.86 v104.3,24.13 102.08,24.13 | v100.17,10.79 v100.17,14.29 v100.17,17.78 v97,20.95 v97,22.86 | 102.08,24.13 98.27,24.13 v97,22.86 | 72.55,18.41 v67.47,23.49 v67.47,25.4 | 35.08,85.72 31.91,82.55 RS1.5 | v35.08,82.55 35.08,85.72 | v60.48,35.24 IC7.P$22 60.48,40.64 59.21,41.91 C_M1.2 56.36,45.72 56.36,48.58 57.63,49.85 72.87,49.85 74.14,48.58 74.14,45.72 v71.28,43.18 | 47.78,93.98 JP6.1 C_F4.2 50.32,85.72 IC7.P$63 C_M3.2 C_AR.1 | IC7.P$53 75.72,85.72 73.5,87.95 70.64,87.95 | X2.7 97,29.53 v97,22.86
  Top 2: 98.18,6.35 73.18,6.35 48.42,6.35 24.92,6.35 22.38,8.89 22.38,15.88 22.38,18.41 19.84,20.95 19.84,23.18 19.84,25.4 17.3,27.94 X6V.2
  Bottom 0.406: 67.15,25.4 v67.47,25.4 | IC6.7 39.23,52.29 C_F11.1 40.48,51.03 v40.48,52.7 | R5.1 v28.1,47.31 | IC2.15 23.65,76.2 23.97,76.52 23.97,79.69 | 23.97,79.69 23.97,80.33 23.02,81.28 v22.07,81.28 | v30.96,66.99 30.32,66.36 30.32,64.88 28.73,63.3 C_X3.+ | 23.02,79.69 C_F3.2 23.97,79.69 | R_D2.2 56.67,70.17 | 56.67,70.17 55.4,71.44 | 55.4,71.44 52.86,71.44 51.59,72.71 51.59,80.01 | D_T1.A 63.02,67.63 | D_T2.A 56.67,67.63 | R_D1.1 63.02,70.8 62.39,71.44 57.94,71.44 | 57.94,71.44 55.4,71.44 | 56.67,70.17 57.94,71.44 | 69.69,62.23 R_D3.1
  Bottom 0.61: IC7.P$63 50.32,84.14 51.59,82.87 54.45,82.87 58.26,79.06 R_P1.2 | R_D1.1 63.02,67.63 63.02,65.41 T1.3 66.52,61.91 | R_D2.2 56.67,67.63 56.67,65.41 T2.3 60.17,61.91 66.52,61.91 | T3.3 70.96,63.5 69.69,62.23 69.37,61.91 66.52,61.91
  Bottom 1.016: CON_VCC_E.8 CON_VCC_E.10 CON_VCC_E.12 C_FC.2 CON_VCC_C.2 CON_VCC_C.4 CON_VCC_C.6 CON_VCC_C.8 CON_VCC_C.10 CON_VCC_C.12 CON_VCC_C.14 CON_VCC_C.16 | CON_VCC_E.6 CON_VCC_E.4 CON_VCC_E.2 C_FE.2 CON_VCC_A.16 CON_VCC_A.14 CON_VCC_A.12 CON_VCC_A.10 CON_VCC_A.8 CON_VCC_A.6 CON_VCC_A.4 CON_VCC_A.2 C_FA.2 | JP_SERVO1.5 JP_SERVO1.6 | JP_SERVO2.6 JP_SERVO2.5 JP_SERVO1.6 | 17.3,14.06 IC8.GND 17.3,17.46 C_V3.2 | 17.3,14.06 C_F14.2 | JP_SERVO1.6 14.76,67.48 C_FS.2 14.94,66.85 12.86,64.77 v12.86,35.56 v12.86,33.66 | D11.A 22.38,25.29 v22.38,22.23 | D3.A v67.47,25.4 | v67.47,25.4 D7.A | 105.57,14.92 IC1.GND | 105.57,17.78 v105.57,22.86 v104.3,24.13 | 105.57,17.78 105.57,14.92 | C_F2.2 105.57,14.92 | C_V2.2 105.57,17.78 | v100.17,10.79 v100.17,14.29 v100.17,17.78 v97,20.95 v97,22.86 v93.82,26.04 v91.28,28.57 v87.79,28.57 v85.88,30.48 v83.98,32.38 v78.9,32.38 v73.18,32.38 v67.47,32.38 v64.61,35.24 v60.48,35.24 v55.4,35.24 v50.96,35.24 v46.83,35.24 v44.61,37.47 v42.39,39.69 v40.16,41.91 v40.16,43.81 | v67.47,25.4 v67.47,23.49 | v17.3,20.64 17.3,14.06 | SV1.10 SV1.8 SV1.6 SV1.4 39.53,74.3 39.53,76.43 C_F12.2 38.49,77.88 35.08,81.28 v35.08,82.55 | IC7.P$53 C_M2.2 | IC7.P$63 C_M3.2 51.59,80.01 C_AR.1 | v71.28,43.18 C_M1.2 | X2.7 X2.8
  pour Top (isolate 1.27): 13.06,93.98 109.22,93.98 109.22,9.53 13.06,9.53
  pour Bottom (isolate 1.27): 13.06,93.98 109.22,93.98 109.22,9.53 13.06,9.53
LCD_DATA4
  Top 0.406: JP6.11 74.45,88.9 79.53,87 IC7.P$51
LCD_DATA5
  Top 0.406: JP6.12 76.99,88.9 82.07,87 IC7.P$50
LCD_DATA6
  Top 0.406: JP6.13 79.53,88.9 84.61,87 IC7.P$49
LCD_DATA7
  Bottom 0.406: IC7.P$48 89.69,91.6 88.42,92.87 82.07,92.87 80.8,91.6 JP6.14
LCD_E
  Bottom 0.406: IC7.P$47 75.72,78.74 74.45,80.01 74.45,87.31 73.18,88.58 61.75,88.58 60.48,89.85 JP6.6
LCD_RS
  Bottom 0.406: JP6.4 55.4,89.85 57.31,87.95 57.94,87.95 59.21,86.68 59.21,83.5 59.85,82.87 71.28,82.87 72.55,81.6 72.55,79.38 75.09,76.84 86.84,76.84 87.47,76.2 IC7.P$46
LCD_RW
  Bottom 0.406: IC7.P$45 91.28,73.66 92.23,74.61 92.23,76.52 91.28,77.47 87.47,77.47 87.15,77.79 75.41,77.79 73.5,79.69 73.5,81.91 71.91,83.5 71.91,86.68 70.96,87.63 60.17,87.63 57.94,89.85 JP6.5
MOTOR_1+
  Top 0.61: XM1.2 18.93,66.36 R_L1.2
  Bottom 1.016: XM1.2 25.88,53.62 25.88,44.13 27.15,42.86 35.08,42.86 45.88,32.07 63.34,32.07 66.83,28.57 76.36,28.57 79.53,25.4 | D4.C 78.26,25.4 | 78.26,25.4 79.53,25.4 | 79.53,25.4 D2.A | IC3.14 74.14,13.33 72.87,14.61 | 72.87,14.61 72.87,20 78.26,25.4 | IC3.2 91.92,10.16 90.65,8.89 76.68,8.89 72.87,12.7 72.87,14.61
MOTOR_1-  (via drill 0.6)
  Top 0.61: XM1.1 16.78,59.21 LED2.A LED3.C 27.21,59.21 C_L1.2
  Top 1.016: D1.A 79.53,25.4 | 79.53,25.4 D3.C | v62.71,30.48 v64.61,28.57 76.36,28.57 79.53,25.4 | IC3.3 90.65,20.95 89.38,22.23 80.8,22.23 | 80.8,22.23 79.53,23.49 | 78.26,22.23 80.8,22.23 | IC3.13 77.95,21.91 79.53,23.49 | 79.53,23.49 79.53,25.4
  Bottom 1.016: XM1.1 24.29,50.2 24.29,42.55 25.56,41.27 34.45,41.27 45.24,30.48 v62.71,30.48 v64.61,28.57
MOTOR_2+
  Top 0.61: XM2.2 18.93,56.2 R_L2.2
  Bottom 1.016: IC4.2 66.83,10.16 65.56,8.89 51.91,8.89 48.1,12.7 48.1,14.61 | IC4.14 49.37,13.33 48.1,14.61 | XM2.2 22.38,46.95 22.38,40.64 23.65,39.37 33.5,39.37 44.29,28.57 52.23,28.57 55.4,25.4 | 55.4,25.4 D6.A 52.86,25.4 48.1,20.64 48.1,14.61 | 55.4,25.4 D8.C
MOTOR_2-  (via drill 0.6)
  Top 0.61: XM2.1 16.78,49.05 LED4.A LED5.C 27.21,49.05 C_L2.2
  Top 1.016: IC4.13 52.86,20.95 54.13,22.23 | 54.13,22.23 56.67,22.23 | 56.67,22.23 64.29,22.23 65.56,20.95 IC4.3 | D7.C 55.4,25.4 | 55.4,25.4 D5.A | 55.4,25.4 55.4,23.49 | 55.4,23.49 54.13,22.23 | 55.4,23.49 56.67,22.23 | v40.16,30.48 v42.07,28.57 52.23,28.57 55.4,25.4
  Bottom 1.016: XM2.1 20.8,43.54 20.8,39.05 22.07,37.78 32.86,37.78 v40.16,30.48 v42.07,28.57
MOTOR_3+
  Top 0.61: XM3.2 18.93,46.04 R_L3.2
  Bottom 1.016: IC5.2 42.07,10.16 40.8,8.89 27.15,8.89 23.34,12.7 23.34,14.61 | XM3.2 17.62,43.14 18.89,41.87 18.89,37.15 20.16,35.88 31.91,35.88 32.86,34.92 32.86,26.67 31.59,25.4 | 29.37,25.4 D12.C 31.59,25.4 | IC5.14 24.61,13.33 23.34,14.61 | 23.34,14.61 23.34,20.95 24.61,22.23 30.32,22.23 31.59,23.49 31.59,25.4 | D10.A 31.59,25.4
MOTOR_3-
  Top 0.406: XM3.1 16.03,38.1
  Top 0.61: XM3.1 16.78,38.89 LED6.A LED7.C 27.21,38.89 C_L3.2
  Top 1.016: IC5.3 40.8,20.95 39.53,22.23 33.81,22.23 | IC5.13 28.1,20.95 29.37,22.23 | 29.37,22.23 33.81,22.23 | 29.37,25.4 D11.C 31.59,25.4 | D9.A 31.59,25.4 | 31.59,25.4 31.59,24.45 | XM3.1 18.3,35.88 31.91,35.88 32.86,34.92 32.86,26.67 31.59,25.4 | 29.37,22.23 31.59,24.45 | 31.59,24.45 33.81,22.23
N$1
  Bottom 0.813: 59.53,57.47 59.53,56.52
N$2
  Bottom 0.406: JP_MOTOR2.4 33.81,53.34 IC6.3
N$3  (via drill 0.5)
  Top 0.406: v60.48,28.89 58.26,31.11 44.61,31.11 35.08,40.64 v35.08,47.94
  Bottom 0.406: IC4.10 56.67,14.61 57.94,15.88 59.21,15.88 60.48,17.14 IC4.7 60.48,20.95 61.12,21.59 61.12,28.26 v60.48,28.89 | IC6.4 v35.08,47.94 IC6.11
N$4
  Bottom 0.406: JP_TWI1.2 86.84,35.88 88.42,37.47 R_U1.2
N$5
  Bottom 0.61: SP1.1 78.26,57.23 78.26,57.47 78.26,58.74 | R_S1.1 78.26,58.74 | T3.1 76.99,63.5 78.26,62.23 78.26,58.74
N$6
  Bottom 0.406: T3.2 R_T3.2
N$7
  Bottom 0.813: 62.71,57.47 62.71,56.52
N$8  (via drill 3.2 pad 7)
  other vias: 5.08,90.17
N$9  (via drill 3.2 pad 7)
  other vias: 115.09,90.17
N$10  (via drill 3.2 pad 7)
  other vias: 5.08,5.08
N$11  (via drill 3.2 pad 7)
  other vias: 115.09,5.08
N$12
  Top 0.61: 5.87,31.75 5.87,32.7 5.87,33.02 | 5.87,33.02 5.87,34.29 | 5.87,33.02 7.14,33.02 | 4.6,33.02 5.87,33.02
N$13
  Bottom 0.813: 58.26,53.98 arc128 63.98,53.98
N$14
  Top 0.61: 5.87,26.67 5.87,29.21
N$15
  Top 0.61: 5.87,22.86 5.87,24.13 | 5.87,22.86 5.87,21.59 | 5.87,22.86 7.14,22.86 | 4.6,22.86 5.87,22.86
N$16
  Top 0.508: R_P1.3 56.67,76.52 54.13,79.06 54.13,87 52.86,88.26 JP6.3
N$17
  Top 0.61: C_AR.2 IC7.P$62
N$18  (via drill 0.5)
  Top 0.305: 61.75,15.88 61.75,20.32
  Top 0.406: IC4.6 61.75,15.88 | 61.75,20.32 61.12,20.95 56.67,20.95 55.4,19.69 IC4.11 | v58.9,28.89 57.63,30.16 44.29,30.16 34.13,40.32 34.13,45.09 | v33.5,50.48 35.08,52.07 JP_MOTOR2.2 | v33.5,47.94 34.13,47.31 34.13,46.67 | 34.13,46.67 34.13,45.09 | R7.2 33.18,46.04 | 33.18,46.04 34.13,46.67 | 33.18,46.04 34.13,45.09
  Bottom 0.406: IC4.11 55.4,19.69 56.67,20.95 58.9,20.95 60.17,22.23 60.17,27.62 v58.9,28.89 | v33.5,50.48 v33.5,47.94
N$19
  Bottom 0.406: JP_TWI2.2 77.15,37.31 86.68,37.31 87.47,38.1 87.47,39.05 88.74,40.32 R_U2.2
N$20
  Top 1.016: D_V1.A 16.61,32.38 X6V.3
N$21  (via drill 0.5)
  Top 0.406: v62.07,28.89 58.9,32.07 44.93,32.07 36.04,40.96 v36.04,44.13
  Bottom 0.305: 63.02,15.88 63.02,11.11
  Bottom 0.406: 63.02,11.11 62.39,10.48 54.77,10.48 54.13,11.11 IC4.12 | v62.07,28.89 62.07,21.59 63.02,20.64 IC4.5 63.02,15.88 | v36.04,44.13 36.35,44.45 IC6.10
N$22
  Bottom 0.61: 4.6,33.02 5.87,33.02 | 5.87,33.02 7.14,33.02 | 5.87,33.02 5.87,31.75 | 5.87,33.02 5.87,34.29
N$23
  Bottom 0.61: 5.87,29.21 5.87,26.67
N$25
  Bottom 0.61: 4.6,22.86 5.87,22.86 | 5.87,22.86 7.14,22.86 | 5.87,22.86 5.87,21.59 | 5.87,24.13 5.87,22.86
N$37
  Top 0.61: IC7.P$23 63.02,40.64 63.98,41.59 63.98,42.55 | 63.98,42.55 63.98,46.04 62.71,47.31 Q1.2 | C_Q1.2 63.98,42.55
N$38
  Top 0.61: LED2.C LED3.A | C_L1.1 27.21,62.71 LED3.A | R_L1.1 24.92,65.89 LED3.A
N$40
  Top 0.61: IC7.P$24 65.56,40.64 66.52,41.59 66.52,43.18 | 66.52,43.18 66.52,46.04 67.79,47.31 Q1.1 | C_Q2.2 66.52,43.18
N$78  (via drill 0.5)
  Top 0.406: v37.94,28.89 37.94,34.61 32.86,39.69 v32.86,44.13
  Bottom 0.254: 38.26,11.11 38.26,15.88
  Bottom 0.406: 38.26,15.88 IC5.5 37.94,18.73 v37.94,28.89 | IC5.12 29.37,11.11 30,10.48 37.62,10.48 38.26,11.11 | v32.86,44.13 33.81,45.09 IC6.12
N$82
  Bottom 0.406: JP_MOTOR1.4 36.35,53.34 IC6.5
N$83
  Bottom 0.305: 88.11,11.11 88.11,15.88
  Bottom 0.406: IC3.12 79.22,11.75 80.49,10.48 87.47,10.48 88.11,11.11 | 88.11,15.88 IC3.5 88.11,19.69 85.88,21.91 85.88,28.26 83.34,30.8 66.83,30.8 63.66,33.97 46.2,33.97 38.89,41.27 IC6.8
N$84  (via drill 0.5)
  Top 0.406: v38.26,47.94 38.26,41.91 46.2,33.97 63.66,33.97 66.83,30.8 81.44,30.8 v82.71,29.53
  Bottom 0.406: IC3.10 81.76,14.61 83.03,15.88 84.3,15.88 85.57,17.14 IC3.7 84.93,19.05 84.93,27.94 83.34,29.53 v82.71,29.53 | IC6.9 37.62,46.99 38.26,47.62 v38.26,47.94 37.94,48.26 37.94,51.12 37.62,51.44 IC6.6
N$90
  Bottom 0.406: JP_MOTOR3.4 28.73,55.88 30.64,55.88 31.27,55.24 IC6.1
N$92
  Bottom 0.508: R_LCD.2 80.8,81.91 79.53,83.19 79.53,86.68 83.34,90.49
  Bottom 0.61: 83.34,90.49 JP6.15
N$95
  Bottom 0.406: R_T2.2 59.85,67.63 D_T2.C 59.85,67.49 T2.2
N$99  (via drill 0.5)
  Top 0.406: v31.27,44.13 31.27,40 36.35,34.92 v36.35,28.89
  Bottom 0.406: IC5.10 31.91,14.61 33.18,15.88 34.45,15.88 35.72,17.14 IC5.7 35.72,20.95 36.99,22.23 36.99,28.26 v36.35,28.89 | v31.27,44.13 32.54,45.4 IC6.13 IC6.2
N$101
  Top 0.61: LED6.C LED7.A | C_L3.1 27.21,42.39 LED7.A | R_L3.1 24.92,45.57 LED7.A
N$106
  Top 0.61: LED4.C LED5.A | C_L2.1 27.21,52.55 LED5.A | R_L2.1 24.92,55.73 LED5.A
N$122
  Bottom 0.406: R_T1.2 66.2,67.63 D_T1.C 66.2,67.49 T1.2
N$123
  Bottom 0.406: IC2.2 28.1,76.2 26.99,75.09 26.99,71.12 24.92,69.06 C_X4.+
N$124
  Bottom 0.406: IC2.6 30,71.12 28.1,69.22 C_X3.-
N$125  (via drill 0.5)
  Top 0.406: 30.53,73.14 30.73,73 | 30.73,73 C_X2.+ | v29.69,74.3 30.73,73.25 30.73,73
  Bottom 0.406: IC2.4 30.32,73.66 v29.69,74.3
N$126  (via drill 0.5)
  Top 0.406: C_X1.+ 28.1,76.31 v28.1,78.1
  Bottom 0.406: 31.59,77.61 IC2.1 28.73,77.47 v28.1,78.1
N$127  (via drill 0.5)
  Top 0.406: C_X1.- | C_X1.- v33.81,76.2
  Bottom 0.406: v33.81,76.2 32.54,74.93 IC2.3
N$128  (via drill 0.5)
  Top 0.406: v28.1,74.3 28.1,72.82 C_X2.-
  Bottom 0.406: IC2.5 28.73,72.39 28.1,73.03 v28.1,74.3
N$129
  Bottom 0.406: R_T1.1 R_D1.2 61.27,74.61 57.63,74.61 56.04,76.2 JP_UART.2
N$130
  Bottom 0.406: R_T2.1 59.85,72.71 57.31,72.71 57.31,72.86 R_D2.1 55.87,73.66 JP_UART.4
N$134  (via drill 0.5)
  Top 0.406: v23.97,72.39 23.97,77.15 26.83,80.01 29.37,80.01 30.32,79.06 37.31,79.06 38.89,77.47 46.51,77.47 47.15,76.84 R_RX.1
  Bottom 0.406: IC2.12 v23.97,72.39
PC0
  Bottom 0.406: CON_DATA_C.1 99.85,29.21 90.96,48.26 IC7.P$35
PC1
  Bottom 0.406: CON_DATA_C.2 99.85,31.75 90.96,50.8 IC7.P$36
PC2
  Bottom 0.406: CON_DATA_C.3 99.85,34.29 90.96,53.34 IC7.P$37
PC3
  Bottom 0.406: IC7.P$38 90.96,55.88 99.85,36.83 CON_DATA_C.4
PC4
  Bottom 0.406: CON_DATA_C.5 99.85,39.37 90.96,58.42 IC7.P$39
PC5
  Bottom 0.406: IC7.P$40 90.96,60.96 99.85,41.91 CON_DATA_C.6
PC6
  Bottom 0.406: CON_DATA_C.7 99.85,44.45 90.96,63.5 IC7.P$41
PC7
  Bottom 0.406: IC7.P$42 90.96,66.04 99.85,46.99 CON_DATA_C.8
PE2
  Top 0.406: IC7.P$4 45.24,73.66 46.83,72.07 69.37,72.07 70.33,73.03 84.3,73.03 87.47,69.85 97.31,69.85 101.12,66.04 CON_DATA_E.1
PE3
  Top 0.406: CON_DATA_E.2 100.17,62.23 98.9,60.96 92.23,60.96 90.96,62.23 87.47,62.23 85.88,63.82 85.88,68.26 83.03,71.12 IC7.P$5
PE4
  Top 0.406: 100.17,59.69 CON_DATA_E.3 87.47,59.69 84.3,62.87 84.3,67.94 82.07,70.17 46.83,70.17 45.24,68.58 IC7.P$6
PE5
  Top 0.406: IC7.P$7 50.01,66.04 53.18,69.22 80.49,69.22 82.71,66.99 82.71,62.55 88.11,57.15 CON_DATA_E.4
PE6
  Top 0.406: CON_DATA_E.5 100.17,54.61 98.9,55.88 92.55,55.88 91.28,54.61 87.47,54.61 86.52,55.56 86.52,56.83 75.09,68.26 53.82,68.26 49.05,63.5 IC7.P$8
PE7  (via drill 0.5)
  Top 0.406: v48.1,60.96 54.45,67.31 74.14,67.31 85.25,56.2 85.25,54.29 87.47,52.07 CON_DATA_E.6
  Bottom 0.406: IC7.P$9 v48.1,60.96
PWM_1
  Bottom 0.406: JP_MOTOR1.1 40.16,56.52 41.75,54.93 41.75,53.02 42.7,52.07 45.56,52.07 46.2,51.44 46.2,47.62 44.29,45.72 IC7.P$15
PWM_2
  Bottom 0.406: JP_MOTOR2.1 36.35,58.42 40.8,58.42 42.07,57.15 45.56,57.15 47.15,55.56 47.15,46.04 44.29,43.18 IC7.P$16
PWM_3
  Bottom 0.406: IC7.P$17 48.1,39.69 48.1,57.47 45.88,59.69 42.07,59.69 41.75,59.37 35.4,59.37 33.81,57.78 33.81,56.52 33.18,55.88 31.91,55.88 30.64,57.15 JP_MOTOR3.1
PWMM1  (via drill 0.5)
  Top 0.305: 86.84,15.88 86.84,20.32
  Top 0.406: IC3.6 86.84,15.88 | 86.84,20.32 86.2,20.95 81.76,20.95 80.49,19.69 IC3.11 | JP_MOTOR1.2 36.67,51.12 v36.67,50.48 | 36.99,46.04 36.99,41.91 45.88,33.02 63.02,33.02 66.2,29.84 80.17,29.84 v81.76,28.26 | R12.2 36.99,46.04 | 36.99,46.04 36.99,47.62 v36.67,47.94
  Bottom 0.406: IC3.11 80.49,19.69 81.76,20.95 82.71,20.95 83.98,22.23 83.98,27.62 83.34,28.26 v81.76,28.26 | v36.67,50.48 v36.67,47.94
PWMM3  (via drill 0.5)
  Top 0.254: 36.99,20.32 36.99,15.88
  Top 0.406: IC5.11 30.64,19.69 31.91,20.95 36.35,20.95 36.99,20.32 | 36.99,15.88 IC5.6 | v34.77,28.89 34.77,35.24 29.69,40.32 v29.69,44.13
  Bottom 0.406: IC5.11 30.64,19.69 31.91,20.95 34.13,20.95 36.04,22.86 36.04,27.62 v34.77,28.89 | v29.69,44.13 30,44.45 30,52.22 | 30,52.22 JP_MOTOR3.2 | R5.2 30,52.22
RESET  (via drill 0.5)
  Top 0.406: T2.1 59.53,61.91 | 59.53,61.91 51.59,61.91 v49.37,59.69 | v97,73.34 v92.87,73.34 | v79.22,68.26 v76.68,68.26 | v70.01,66.04 70.01,63.5 68.42,61.91 59.53,61.91
  Bottom 0.406: SV1.5 36.35,68.58 36.35,63.82 36.99,63.18 41.12,63.18 42.07,62.23 48.74,62.23 49.37,61.59 v49.37,59.69 49.37,43.18 50.64,41.91 54.13,41.91 55.4,40.64 IC7.P$20 | v92.87,73.34 91.92,72.39 83.34,72.39 v79.22,68.26 | v76.68,68.26 71.28,68.26 70.01,66.99 v70.01,66.04 | v97,73.34 97,71.12 94.46,68.58 JP_RESET.4
RX0
  Top 0.406: IC7.P$2 47,78.74 R_RX.2
RX1  (via drill 0.5)
  Top 0.406: IC7.P$27 73.18,40.64 79.85,47.31 83.66,47.31 v86.52,50.48
  Bottom 0.406: X1.3 95.41,88.58 95.41,71.44 91.28,67.31 87.47,67.31 86.52,66.36 v86.52,50.48
SCK  (via drill 0.5)
  Top 0.406: IC7.P$11 43.34,55.88 40.8,58.42 35.08,58.42 33.81,59.69 33.81,60.96 32.54,62.23 v32.54,62.55
  Bottom 0.406: v32.54,62.55 32.54,64.77 SV1.7
SCL
  Top 0.406: IC7.P$25 68.1,35.24 69.37,33.97 84.93,33.97 85.25,33.66 90.33,33.66 X2.5
  Bottom 0.406: X2.6 93.82,35.88 93.82,39.37 92.87,40.32 R_U2.1
  Bottom 1.016: X2.5 X2.6
SDA
  Top 0.406: IC7.P$26 70.64,38.1 71.44,37.31 87.95,37.31 X2.4
  Bottom 0.406: X2.4 92.07,36.66 R_U1.1
  Bottom 1.016: X2.3 X2.4
SERVO1  (via drill 0.5)
  Top 0.406: JP_SERVO1.2 21.43,68.26 29.05,68.26 29.69,67.63 29.69,66.36 30.32,65.72 30.96,65.72 34.45,62.23 37.94,62.23 40.48,64.77 v48.42,64.77
  Bottom 0.406: v48.42,64.77 49.05,64.77 50.96,62.87 50.96,46.35 52.23,45.09 73.82,45.09 78.26,40.64 IC7.P$29
SERVO2  (via drill 0.5)
  Top 0.406: v39.21,66.04 34.13,66.04 30.64,69.22 22.7,69.22 19.84,72.07 JP_SERVO1.1
  Bottom 0.406: v39.21,66.04 40.48,64.77 46.51,64.77 47.78,66.04 49.69,66.04 52.23,63.5 52.23,47.62 53.5,46.35 75.09,46.35 80.8,40.64 IC7.P$30
SERVO3  (via drill 0.5)
  Top 0.406: v48.42,67.31 41.75,67.31 40.48,68.58 34.13,68.58 31.91,70.17 23.02,70.17 21.43,71.75 21.43,73.03 19.84,74.61 JP_SERVO2.2
  Bottom 0.406: v48.42,67.31 50.64,67.31 53.5,64.45 53.5,48.9 54.77,47.62 76.36,47.62 83.34,40.64 IC7.P$31
SERVO4  (via drill 0.5)
  Top 0.406: v39.21,71.12 23.34,71.12 22.38,72.07 22.38,73.34 21.43,74.3 21.43,75.56 19.84,77.15 JP_SERVO2.1
  Bottom 0.406: v39.21,71.12 40.48,69.85 40.48,68.58 41.75,67.31 46.51,67.31 47.78,68.58 51.59,68.58 54.77,65.41 54.77,50.16 56.04,48.9 77.63,48.9 85.88,40.64 IC7.P$32
TX0  (via drill 0.5)
  Top 0.406: v25.56,72.39 25.56,77.15 27.46,79.06 29.05,79.06 30,78.1 36.99,78.1 38.89,76.2 IC7.P$3
  Bottom 0.406: IC2.11 24.92,71.12 25.56,71.75 v25.56,72.39
TX1  (via drill 0.5)
  Top 0.406: IC7.P$28 75.72,40.64 80.8,45.72 83.66,45.72 v85.25,47.31
  Bottom 0.406: X1.2 93.5,88.58 94.46,87 94.46,72.39 91.92,69.85 87.47,69.85 85.25,67.63 v85.25,47.31
V+
  Top 1.016: JP_SERVO2.4 JP_SERVO2.3 JP_SERVO1.4 | JP_SERVO1.4 JP_SERVO1.3 | JP_SERVO1.4 17.3,69.22 12.86,64.77 12.86,38.1 10.95,36.2 10.95,22.23 10.95,20.32 10.95,18.73 12.22,17.46 C_V4.1 14.76,17.46 IC8.OUT 14.76,14.61 C_F13.1
  Bottom 1.016: JP_SERVO2.4 JP_SERVO2.3 JP_SERVO1.4 | JP_SERVO1.3 JP_SERVO1.4 | C_FS.1 17.3,67.94 JP_SERVO1.4
(copper drawn outside any net)
  shapes: Bottom circle x2

### Text on the board
Top: TX | 6 | 5 | 4 | Servo | 1 | 3 | 2 | 2 | 3 | PortF | 1 | 4 | 0 | 7 | M1 | 6 | 5 | Peter Weissig | 4 | V 7.0.2 | 3 | PortE | M2 | 26.11.2014 | 2 | Boot | 7 | PvP | 6 | M3 | 5 | 4 | TWI | 3 | 2 | PortC | 1 | 0 | Keplerboard
Bottom: RS232
tNames: ISP | 3 | 2 | 1 | Jumper TWI